# EAGLE design CrackberryPi_1.0.5_test (EAGLE 7.2.0)
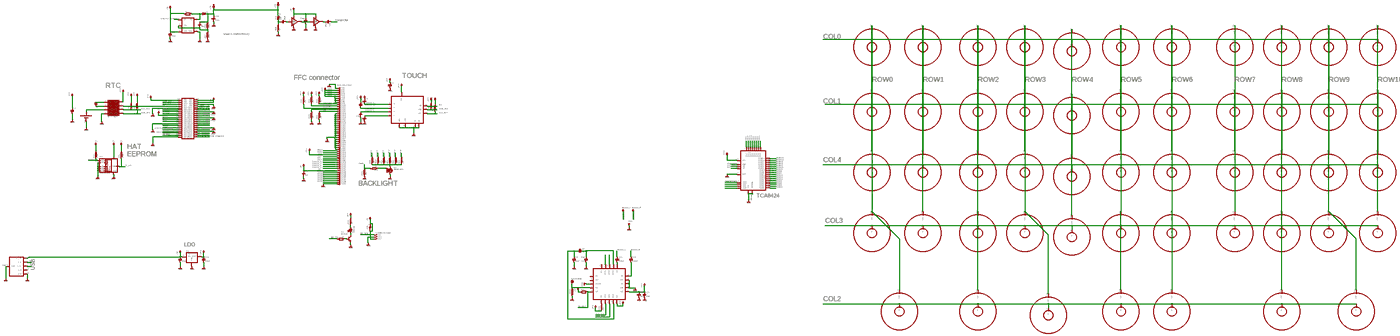
[diagram p0: schematic, sheet 1, overview]
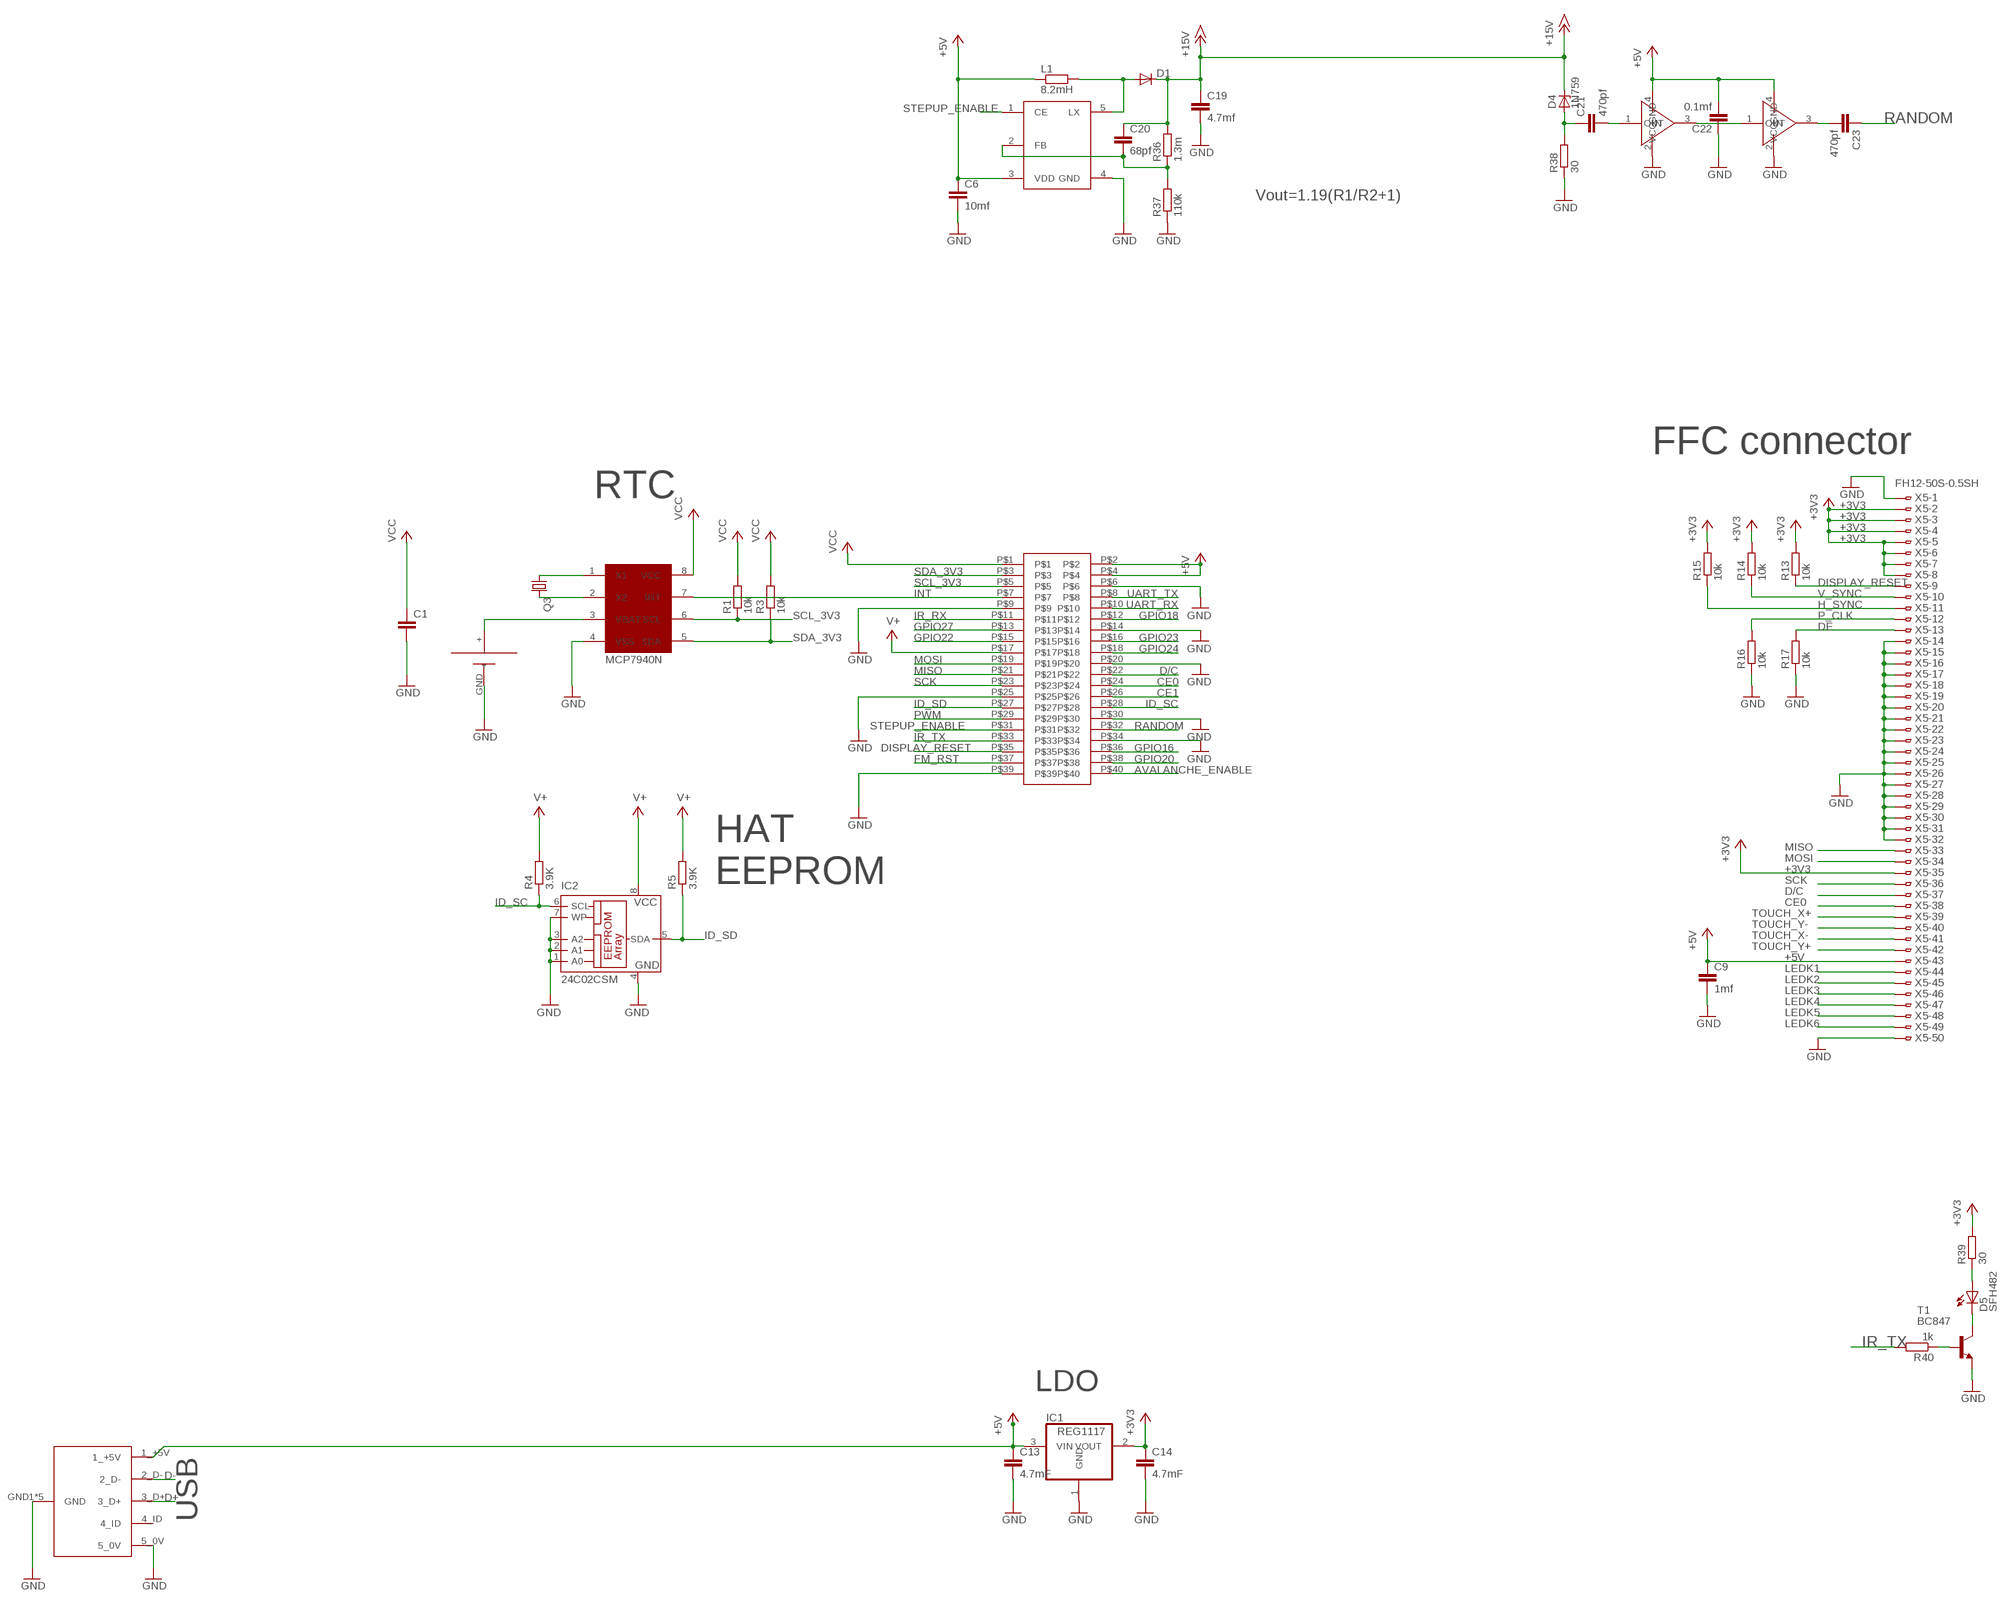
[diagram p1: schematic, sheet 1, part 1 of 4]
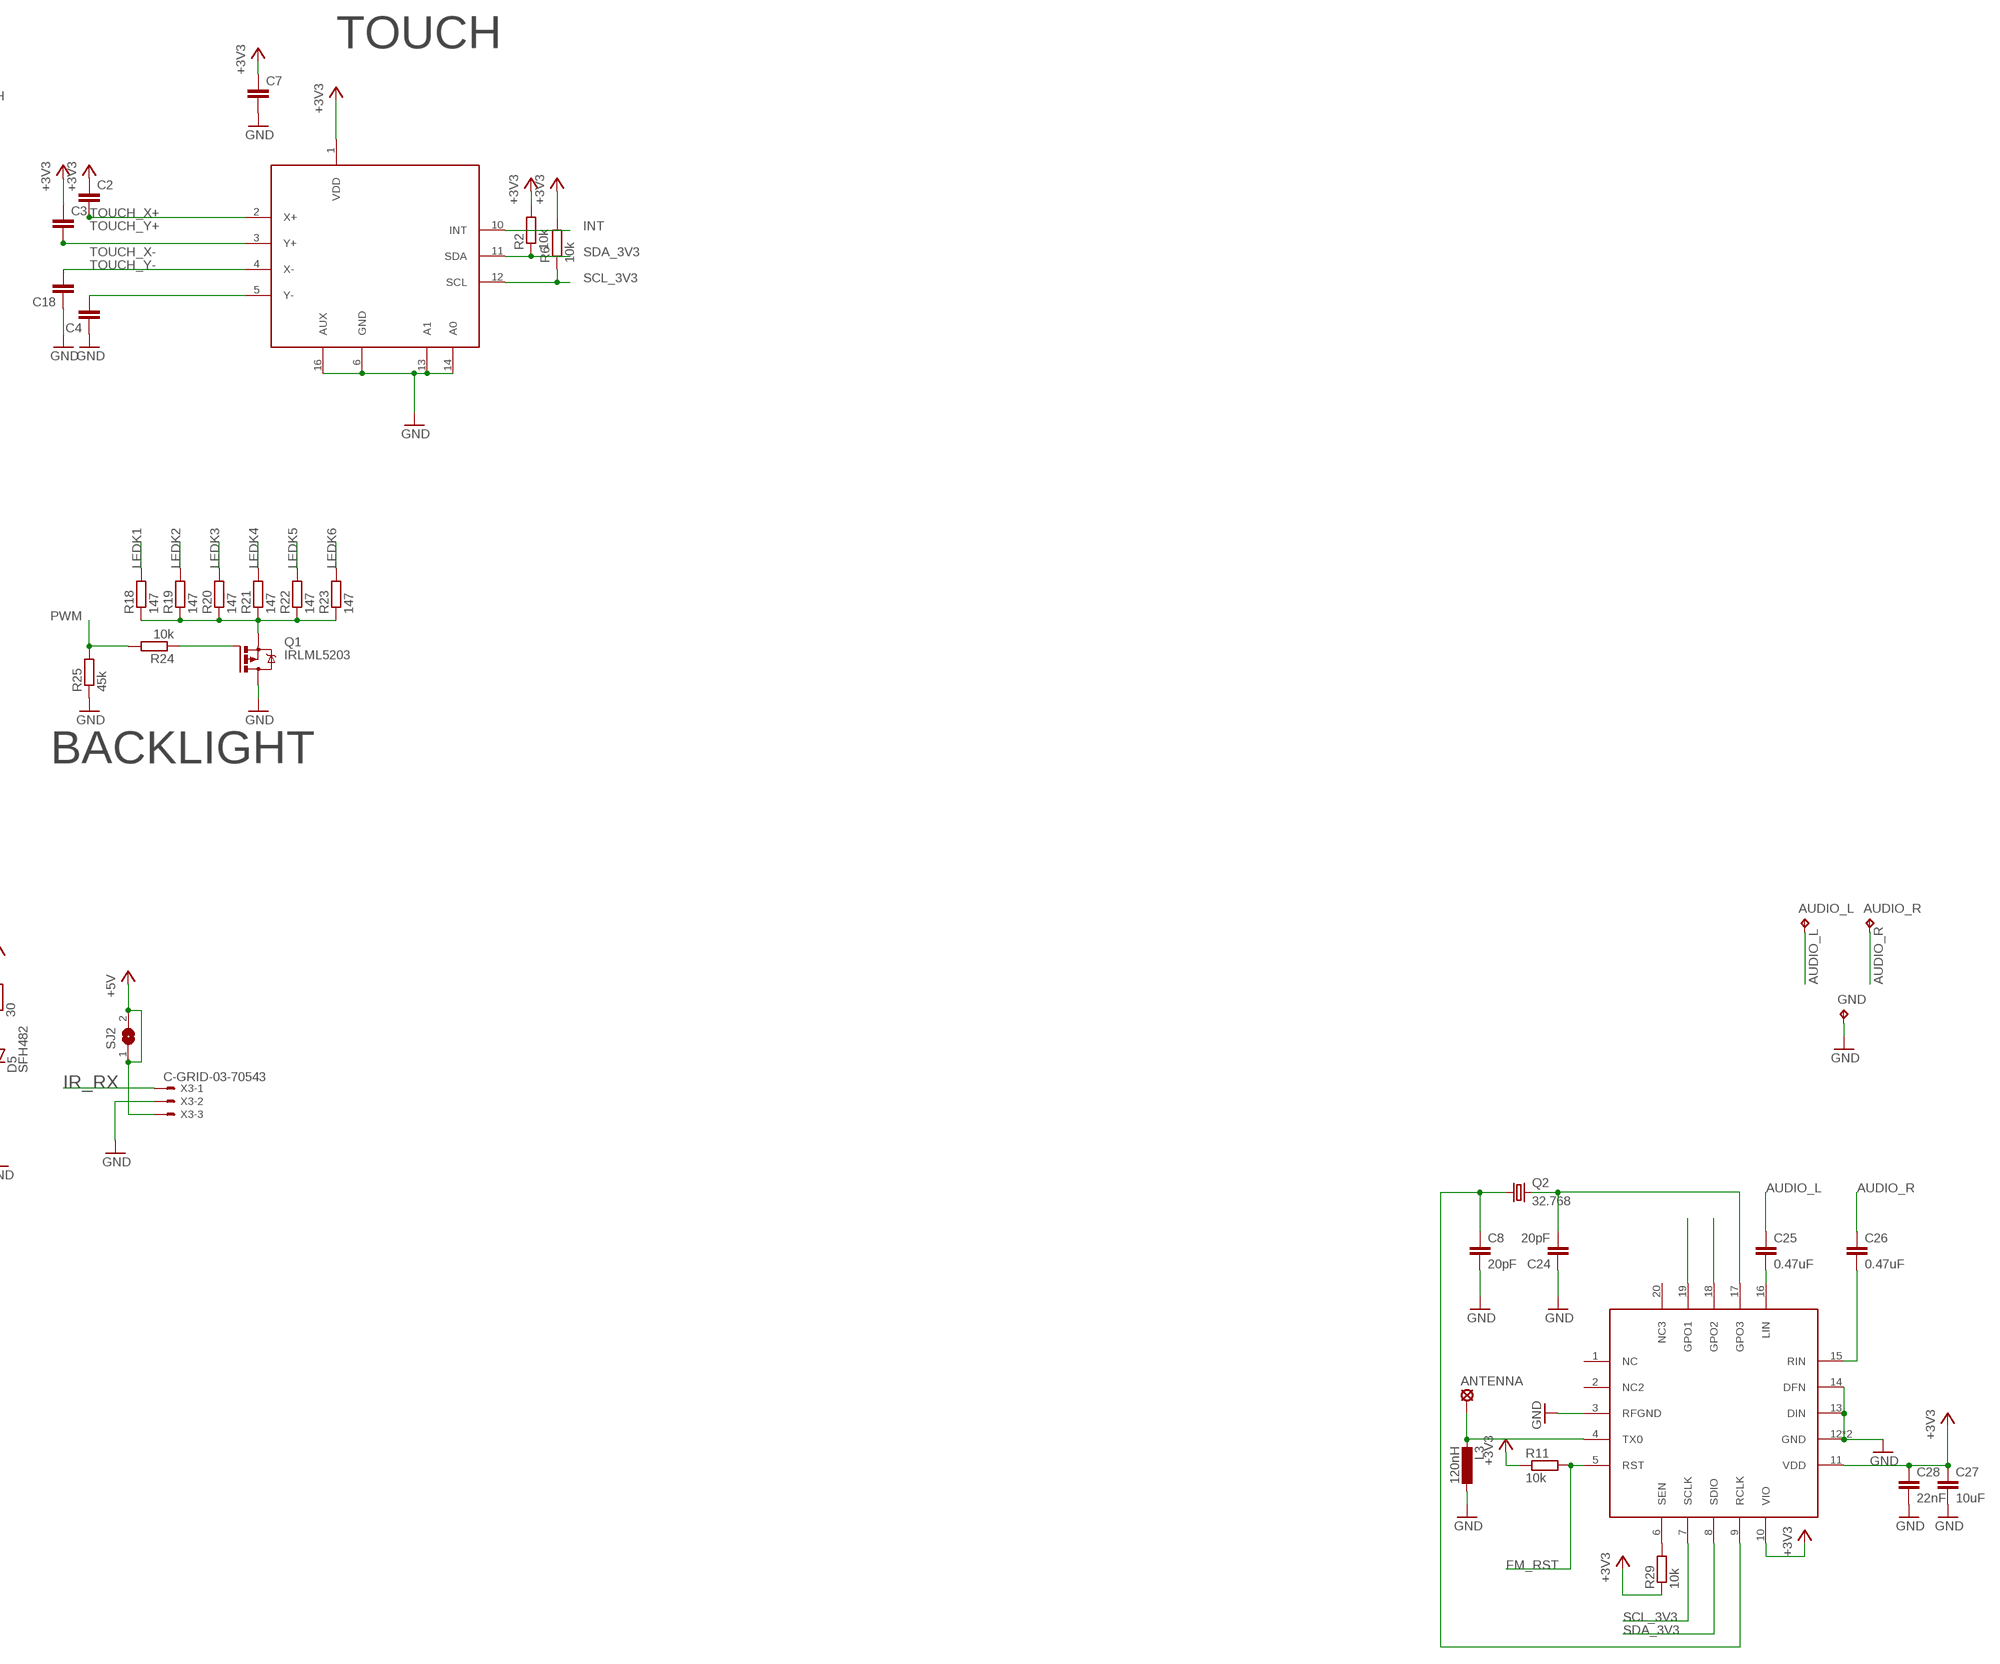
[diagram p2: schematic, sheet 1, part 2 of 4]
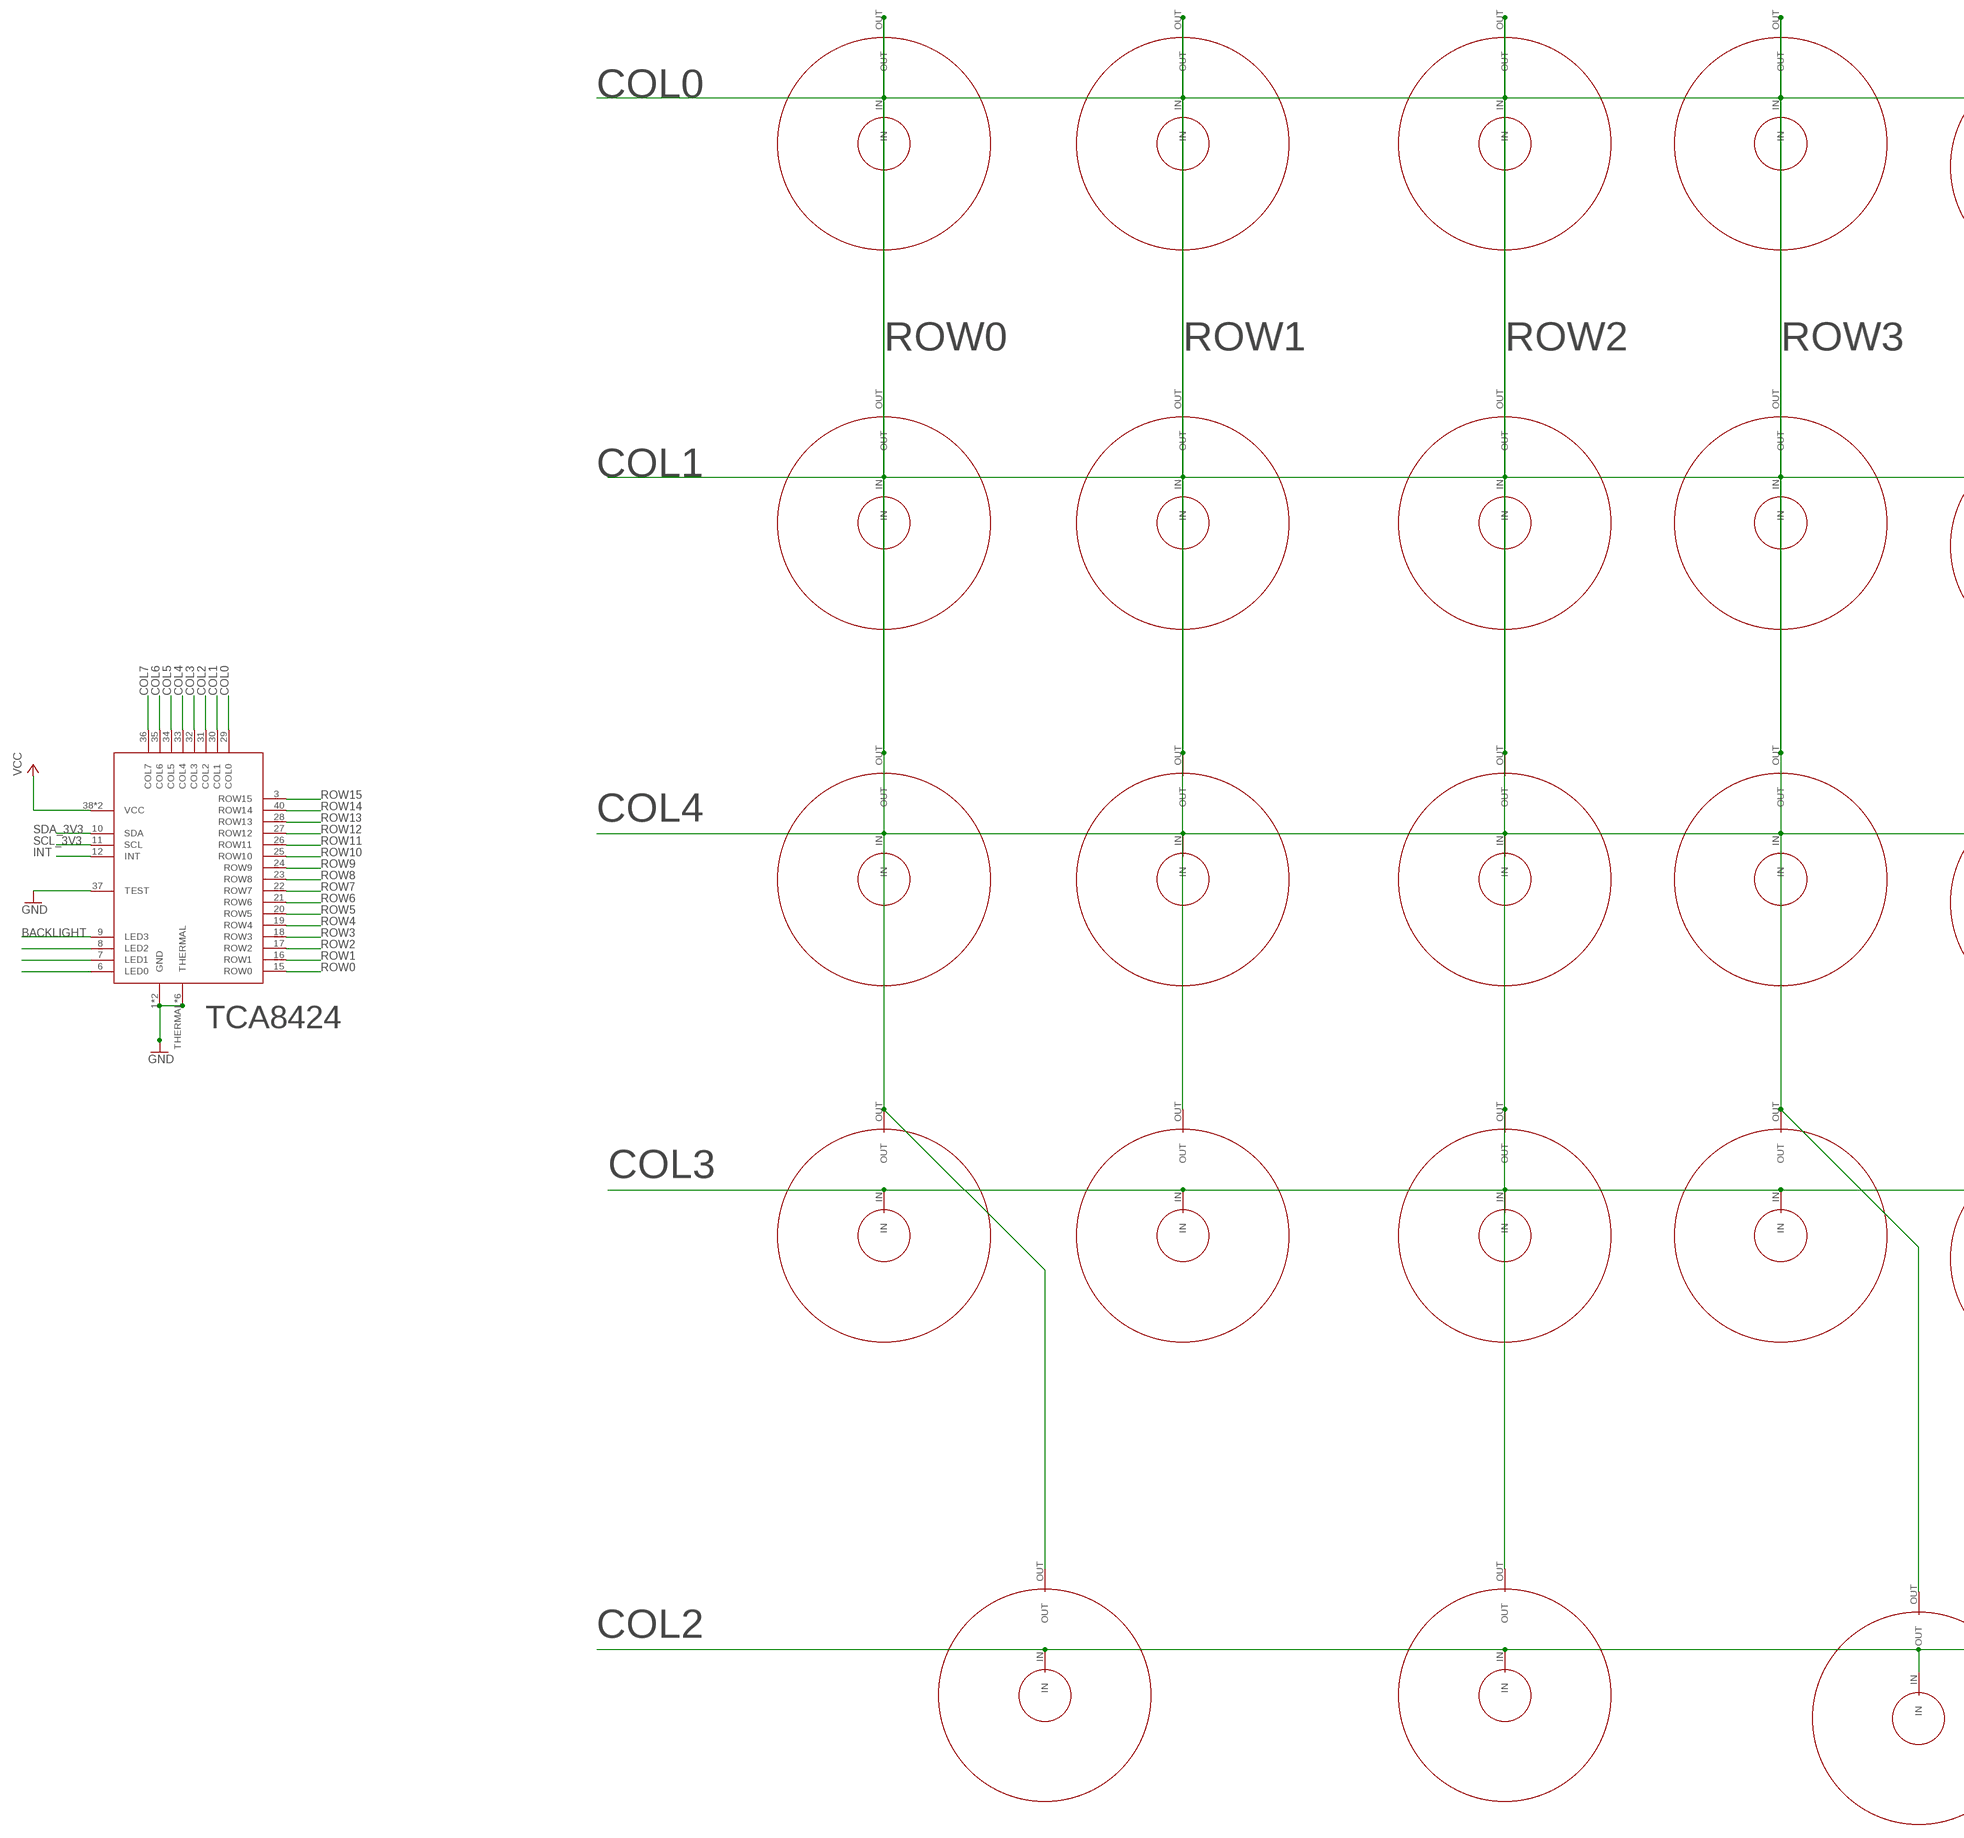
[diagram p3: schematic, sheet 1, part 3 of 4]
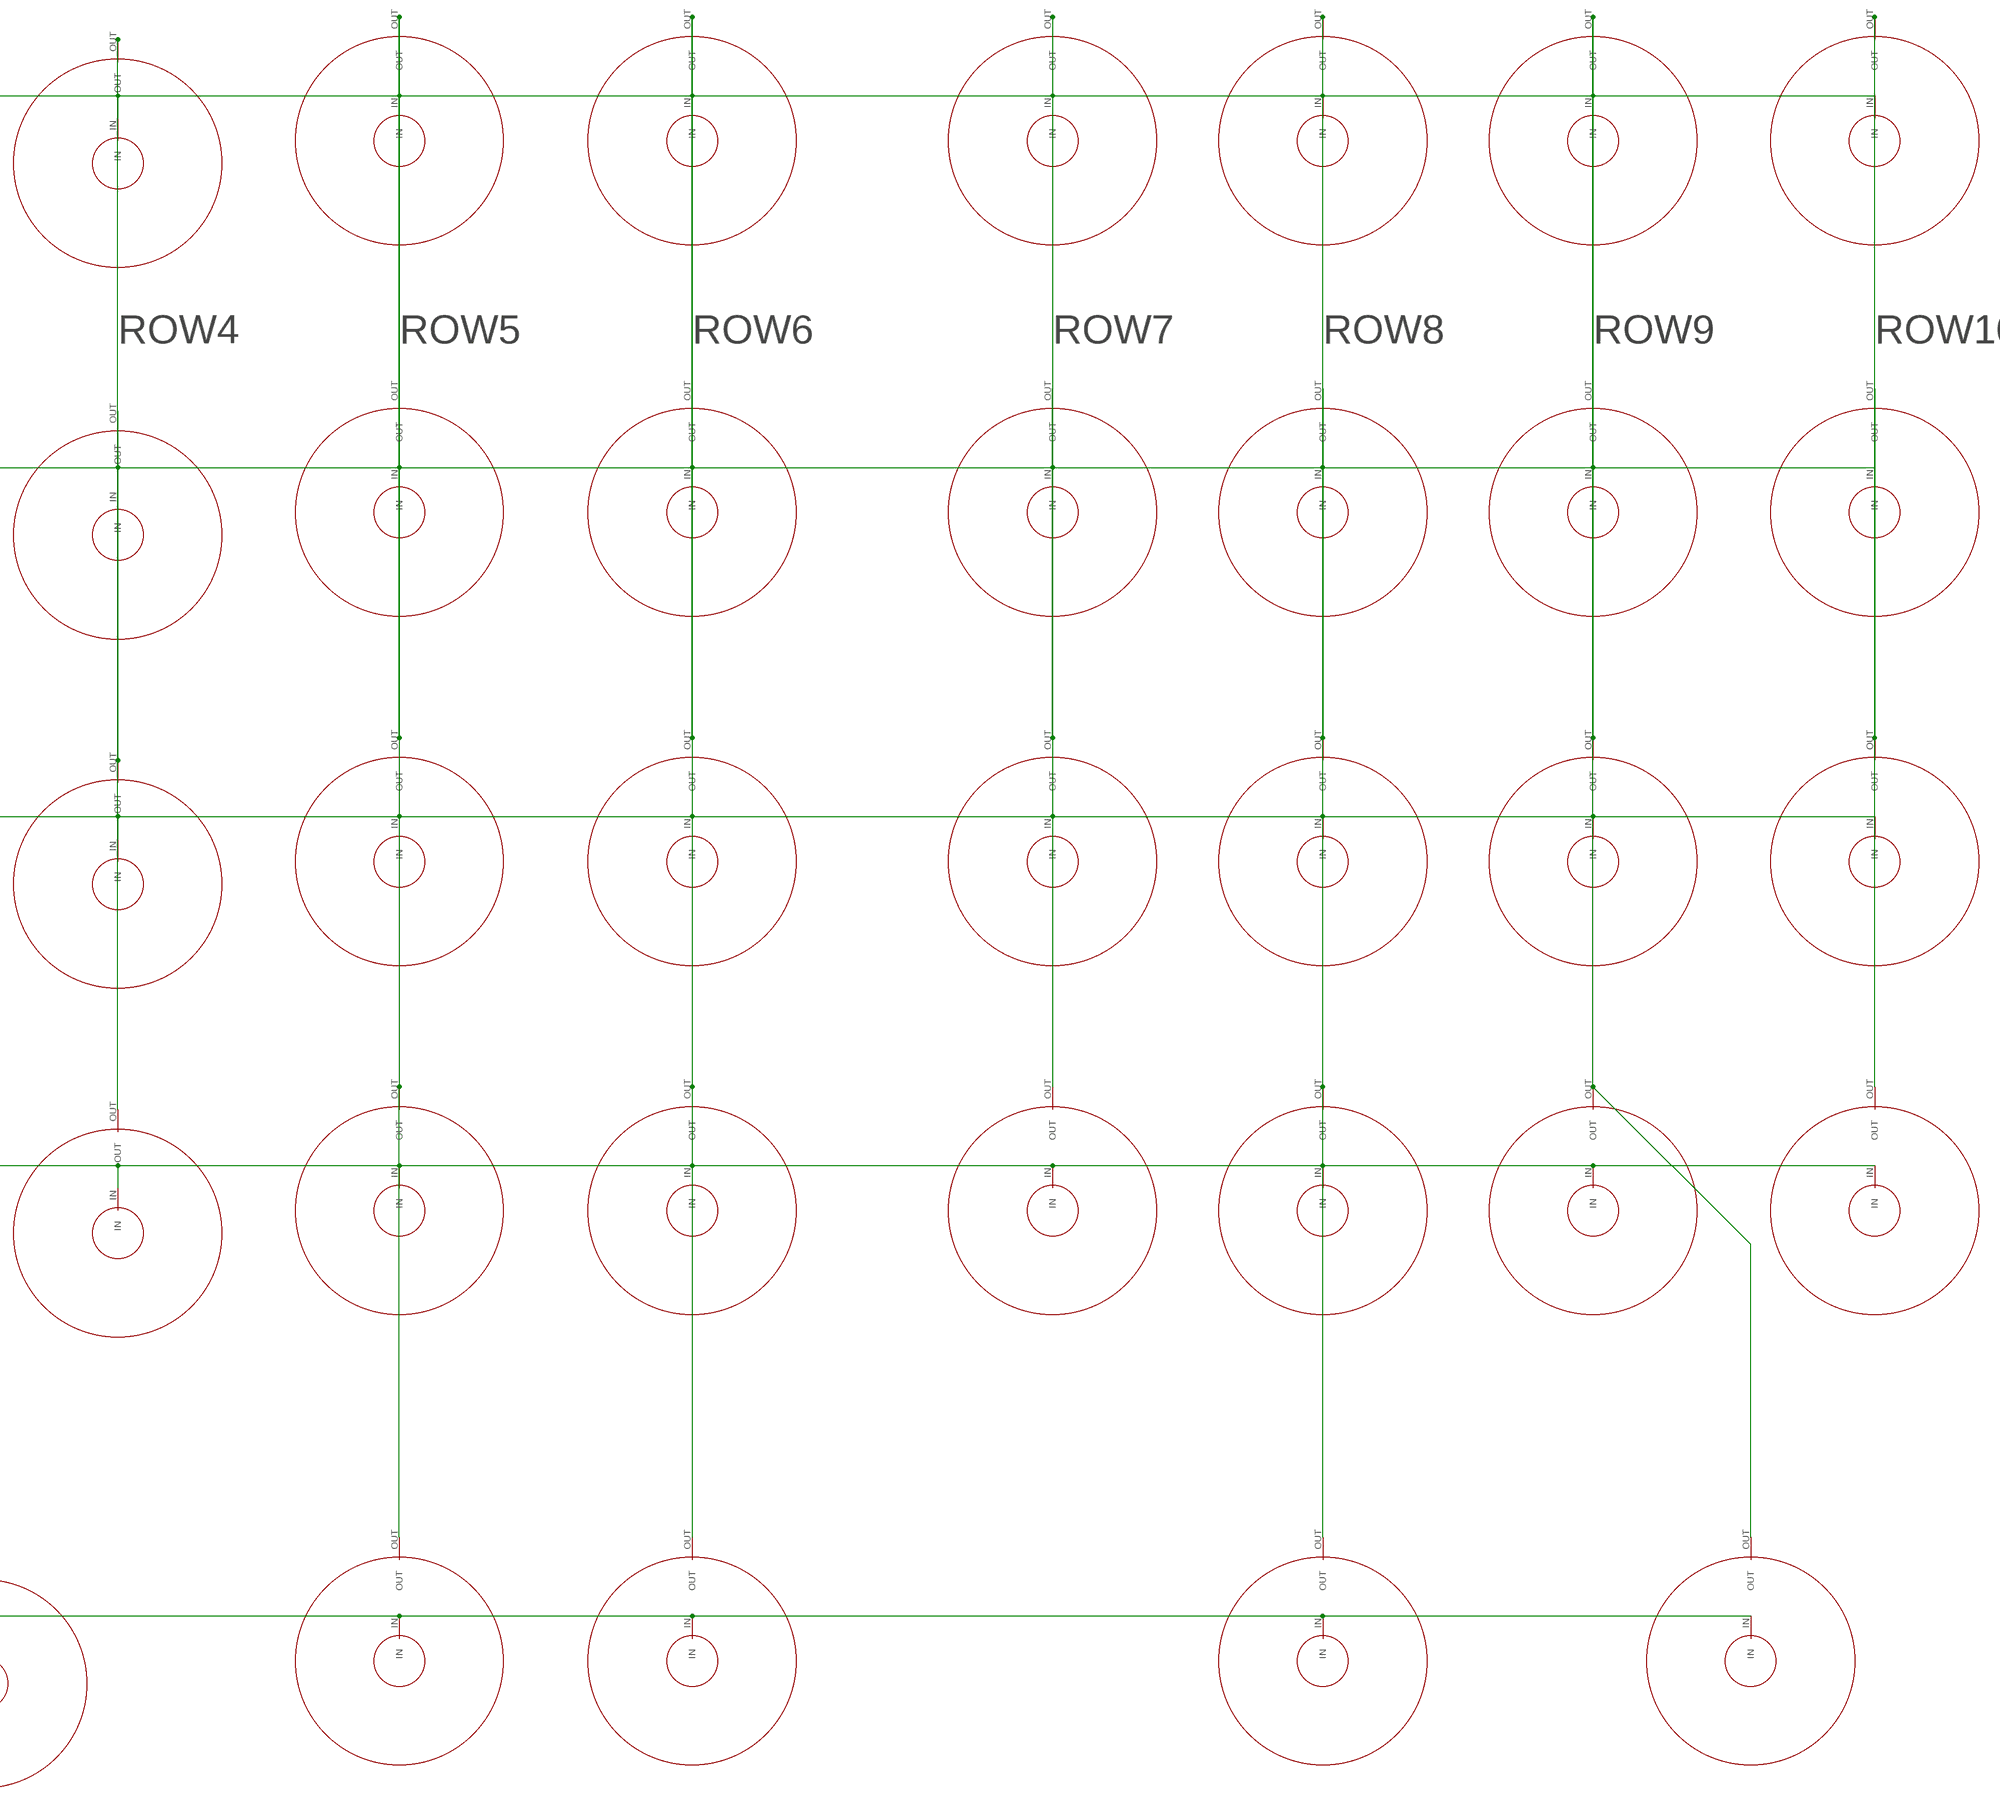
[diagram p4: schematic, sheet 1, part 4 of 4]

## Parts
0  DOME  [4MM]
1  DOME  [4MM]
2  DOME  [4MM]
3  DOME  [4MM]
4  DOME  [4MM]
5  DOME  [4MM]
6  DOME  [4MM]
7  DOME  [4MM]
8  DOME  [4MM]
9  DOME  [4MM]
!  DOME  [4MM]
(  DOME  [4MM]
)  DOME  [4MM]
+  DOME  [4MM]
,  DOME  [4MM]
-  DOME  [4MM]
.  DOME  [4MM]
?  DOME  [4MM]
@  DOME  [4MM]
A  DOME  [4MM]
ANTENNA  LSP10  [LSP10]
AUDIO_L  TPB2,54  [B2,54]
AUDIO_R  TPB2,54  [B2,54]
B  DOME  [4MM]
C  DOME  [4MM]
C1  C-EUC0603  [C0603]
C2  C-EUC0603  [C0603]
C3  C-EUC0603  [C0603]
C4  C-EUC0603  [C0603]
C6  10mf  C-EUC0603  [C0603]
C7  C-EUC0603  [C0603]
C8  20pF  C-EUC0603  [C0603]
C9  1mf  C-EUC0603  [C0603]
C13  4.7mF  C-EUC0603  [C0603]
C14  4.7mF  C-EUC0603  [C0603]
C18  C-EUC0603  [C0603]
C19  4.7mf  C-EUC0603  [C0603]
C20  68pf  C-EUC0603  [C0603]
C21  470pf  C-EUC0603  [C0603]
C22  0.1mf  C-EUC0603  [C0603]
C23  470pf  C-EUC0603  [C0603]
C24  20pF  C-EUC0603  [C0603]
C25  0.47uF  C-EUC0603  [C0603]
C26  0.47uF  C-EUC0603  [C0603]
C27  10uF  C-EUC0603  [C0603]
C28  22nF  C-EUC0603  [C0603]
D  DOME  [4MM]
D1  DIODE-SOD123  [SOD123]
D4  1N759  ZENER-DIODESOD80C  [SOD80C]
D5  SFH482  [SFH482]
E  DOME  [4MM]
F  DOME  [4MM]
FN-RIGHT  DOME  [4MM]
G  DOME  [4MM]
GND  TPB2,54  [B2,54]
H  DOME  [4MM]
I  DOME  [4MM]
IC1  REG1117  [SOT223]
IC2  24C02CSM  [SO-08M]
J  DOME  [4MM]
K  DOME  [4MM]
L  DOME  [4MM]
L1  8.2mH  R-EU_R0805  [R0805]
L3  120nH  L-EUL2012C  [L2012C]
M  DOME  [4MM]
N  DOME  [4MM]
O  DOME  [4MM]
P  DOME  [4MM]
Q  DOME  [4MM]
Q1  IRLML5203  [MICRO3]
Q2  32.768  CRYSTALMM20SS  [MM20SS]
Q3  CRYSTALMM20SS  [MM20SS]
R  DOME  [4MM]
R1  10k  R-EU_R0603  [R0603]
R2  10k  R-EU_R0603  [R0603]
R3  10k  R-EU_R0603  [R0603]
R4  3.9K  R-EU_R0603  [R0603]
R5  3.9K  R-EU_R0603  [R0603]
R6  10k  R-EU_R0603  [R0603]
R11  10k  R-EU_R0603  [R0603]
R13  10k  R-EU_R0603  [R0603]
R14  10k  R-EU_R0603  [R0603]
R15  10k  R-EU_R0603  [R0603]
R16  10k  R-EU_R0603  [R0603]
R17  10k  R-EU_R0603  [R0603]
R18  147  R-EU_R0603  [R0603]
R19  147  R-EU_R0603  [R0603]
R20  147  R-EU_R0603  [R0603]
R21  147  R-EU_R0603  [R0603]
R22  147  R-EU_R0603  [R0603]
R23  147  R-EU_R0603  [R0603]
R24  10k  R-EU_R0603  [R0603]
R25  45k  R-EU_R0603  [R0603]
R29  10k  R-EU_R0603  [R0603]
R36  1.3m  R-EU_R0603  [R0603]
R37  110k  R-EU_R0603  [R0603]
R38  30  R-EU_R0603  [R0603]
R39  30  R-EU_R0603  [R0603]
R40  1k  R-EU_R0603  [R0603]
S  DOME  [4MM]
SHIFT-RIGHT  DOME  [4MM]
SHILFT-LEFT  DOME  [4MM]
SJ2  SJ  [SJ]
SPACE1  DOME  [4MM]
SPACE2  DOME  [4MM]
SPACE3  DOME  [4MM]
T  DOME  [4MM]
T1  BC847  [SOT23]
U  DOME  [4MM]
U$2  NCP1406  [SOT23-5L]
U$3  MAX2650  [SOT143-W]
U$4  CR1216  [CR1216]
U$5  MCP7940N  [SO08]
U$6  TSC2007  [TSSOP16]
U$7  TCA8424  [QFN40]
U$8  SI4713  [QFN20-3X3]
U$9  MICRO_USB  [MICRO_USB]
U$10  MAX2650  [SOT143-W]
U$11  HEADER  [20X2]
V  DOME  [4MM]
W  DOME  [4MM]
X  DOME  [4MM]
X3  C-GRID-03-70543  [70543-03]
X5  FH12-50S-0.5SH  [FH12-50S-0.5SH]
Y  DOME  [4MM]
Z  DOME  [4MM]

## Nets
+3V3: C2.1 C3.1 C7.1 C14.1 C27.1 C28.1 IC1.2(VOUT) R2.2 R6.2 R11.1 R13.2 R14.2 R15.2 R29.1 R39.2 U$6.1(VDD) U$8.10(VIO) U$8.11(VDD) X5.2 X5.3 X5.4 X5.5 X5.6 X5.7 X5.8 X5.35
+5V: C6.1 C9.1 C13.1 C22.2 IC1.3(VIN) L1.1 SJ2.1 SJ2.2 U$2.3(VDD) U$3.4(VCC) U$9.1_+5V U$10.4(VCC) U$11.P$2 U$11.P$4 X3.3 X5.43
+15V: C19.1 C20.1 D1.C D4.C R36.2
AUDIO_L: AUDIO_L.TP C25.1
AUDIO_R: AUDIO_R.TP C26.1
AVALANCHE_ENABLE: U$11.P$40
BACKLIGHT: U$7.9(LED3)
BASE: R40.1 T1.1(B)
CE0: U$11.P$24 X5.38
CE1: U$11.P$26
COL0: 0.IN 1.IN 2.IN 3.IN 4.IN 5.IN 6.IN 7.IN 8.IN 9.IN -.IN U$7.29(COL0)
COL1: +.IN E.IN I.IN O.IN P.IN Q.IN R.IN T.IN U$7.30(COL1) U.IN W.IN Y.IN
COL2: @.IN FN-RIGHT.IN SHIFT-RIGHT.IN SHILFT-LEFT.IN SPACE1.IN SPACE2.IN SPACE3.IN U$7.31(COL2)
COL3: !.IN ,.IN ..IN ?.IN B.IN C.IN M.IN N.IN U$7.32(COL3) V.IN X.IN Z.IN
COL4: (.IN ).IN A.IN D.IN F.IN G.IN H.IN J.IN K.IN L.IN S.IN U$7.33(COL4)
COL5: U$7.34(COL5)
COL6: U$7.35(COL6)
COL7: U$7.36(COL7)
COLLECTOR: D5.K(C) T1.3(C)
D+: U$9.3_D+
D-: U$9.2_D-
D/C: U$11.P$22 X5.37
DE: R17.2 X5.13
DISPLAY_RESET: R13.1 U$11.P$35 X5.9
EMITTER: T1.2(E) ; supply symbol labelled GND
FB: C20.2 R36.1 R37.2 U$2.2(FB)
FM_RST: R11.2 U$8.5(RST) U$11.P$37
GND: C1.2 C4.1 C6.2 C7.2 C8.2 C9.2 C13.2 C14.2 C18.1 C19.2 C22.1 C24.1 C27.2 C28.2 GND.TP IC1.1(GND) IC2.1(A0) IC2.2(A1) IC2.3(A2) IC2.4(GND) IC2.7(WP) L3.1 Q1.3(D) R16.1 R17.1 R25.1 R37.1 R38.1 U$2.4(GND) U$3.2(GND) U$4.GND(-) U$5.4(VSS) U$6.6(GND) U$6.13(A1) U$6.14(A0) U$6.16(AUX) U$7.1(GND) U$7.4(GND) U$7.37(TEST) U$7.THERMAL U$7.VIA1(THERMAL) U$7.VIA2(THERMAL) U$7.VIA3(THERMAL) U$7.VIA4(THERMAL) U$7.VIA5(THERMAL) U$8.3(RFGND) U$8.12(GND) U$8.13(DIN) U$8.14(DFN) U$8.P$1(GND) U$9.5_0V U$9.GND1(GND) U$9.GND2(GND) U$9.GND5(GND) U$9.P$1(GND) U$9.P$7(GND) U$10.2(GND) U$11.P$6 U$11.P$9 U$11.P$14 U$11.P$20 U$11.P$25 U$11.P$30 U$11.P$34 U$11.P$39 X3.2 X5.1 X5.14 X5.15 X5.16 X5.17 X5.18 X5.19 X5.20 X5.21 X5.22 X5.23 X5.24 X5.25 X5.26 X5.27 X5.28 X5.29 X5.30 X5.31 X5.32 X5.50
GPIO16: U$11.P$36
GPIO18: U$11.P$12
GPIO20: U$11.P$38
GPIO22: U$11.P$15
GPIO23: U$11.P$16
GPIO24: U$11.P$18
GPIO27: U$11.P$13
GPO1: U$8.19(GPO1)
GPO2: U$8.18(GPO2)
H_SYNC: R15.1 X5.11
ID_SC: IC2.6(SCL) R4.1 U$11.P$28
ID_SD: IC2.5(SDA) R5.1 U$11.P$27
IN_1: C21.2 U$3.1(IN)
INT: U$5.7(INT) U$6.10(INT) U$7.12(INT) U$11.P$7
IR_RX: U$11.P$11 X3.1
IR_TX: R40.2 U$11.P$33
LEDK1: R18.2 X5.44
LEDK2: R19.2 X5.45
LEDK3: R20.2 X5.46
LEDK4: R21.2 X5.47
LEDK5: R22.2 X5.48
LEDK6: R23.2 X5.49
LX: D1.A L1.2 U$2.5(LX)
MISO: U$11.P$21 X5.33
MOSI: U$11.P$19 X5.34
N$1: C24.2 Q2.4 U$8.17(GPO3)
N$10: U$7.6(LED0)
N$11: Q3.1 U$5.1(X1)
N$12: Q1.2(S) R18.1 R19.1 R20.1 R21.1 R22.1 R23.1
N$13: Q3.4 U$5.2(X2)
N$14: U$7.7(LED1)
N$16: C21.1 D4.A R38.2
N$18: U$7.8(LED2)
N$19: C8.1 Q2.1 U$8.9(RCLK)
N$20: Q1.1(G) R24.1
N$22: C25.2 U$8.16(LIN)
N$23: C26.2 U$8.15(RIN)
N$25: ANTENNA.MP L3.2 U$8.4(TX0)
N$26: R29.2 U$8.6(SEN)
N$30: D5.A R39.1
OUT1_IN2: U$3.3(OUT) U$10.1(IN)
OUT2: C23.2 U$10.3(OUT)
P_CLK: R16.2 X5.12
PWM: R24.2 R25.2 U$11.P$29
RANDOM: C23.1 U$11.P$32
ROW0: 1.OUT A.OUT Q.OUT SHILFT-LEFT.OUT U$7.15(ROW0) Z.OUT
ROW1: 2.OUT S.OUT U$7.16(ROW1) W.OUT X.OUT
ROW2: 3.OUT C.OUT D.OUT E.OUT SPACE1.OUT U$7.17(ROW2)
ROW3: 4.OUT F.OUT R.OUT SPACE2.OUT U$7.18(ROW3) V.OUT
ROW4: 5.OUT B.OUT G.OUT T.OUT U$7.19(ROW4)
ROW5: 6.OUT H.OUT N.OUT SPACE3.OUT U$7.20(ROW5) Y.OUT
ROW6: 7.OUT J.OUT M.OUT SHIFT-RIGHT.OUT U$7.21(ROW6) U.OUT
ROW7: 8.OUT ?.OUT I.OUT K.OUT U$7.22(ROW7)
ROW8: 9.OUT !.OUT @.OUT L.OUT O.OUT U$7.23(ROW8)
ROW9: 0.OUT (.OUT ,.OUT FN-RIGHT.OUT P.OUT U$7.24(ROW9)
ROW10: ).OUT +.OUT -.OUT ..OUT U$7.25(ROW10)
ROW11: U$7.26(ROW11)
ROW12: U$7.27(ROW12)
ROW13: U$7.28(ROW13)
ROW14: U$7.40(ROW14)
ROW15: U$7.3(ROW15)
SCK: U$11.P$23 X5.36
SCL_3V3: R1.1 R6.1 U$5.6(SCL) U$6.12(SCL) U$7.11(SCL) U$8.7(SCLK) U$11.P$5
SDA_3V3: R2.1 R3.1 U$5.5(SDA) U$6.11(SDA) U$7.10(SDA) U$8.8(SDIO) U$11.P$3
STEPUP_ENABLE: U$2.1(CE) U$11.P$31
TOUCH_X+: C2.2 U$6.2(X+) X5.39
TOUCH_X-: C18.2 U$6.4(X-) X5.41
TOUCH_Y+: C3.2 U$6.3(Y+) X5.42
TOUCH_Y-: C4.2 U$6.5(Y-) X5.40
UART_RX: U$11.P$10
UART_TX: U$11.P$8
V+: IC2.8(VCC) R4.2 R5.2 U$11.P$17
V_SYNC: R14.1 X5.10
VBAT+: U$4.+ U$5.3(VBAT)
VCC: C1.1 R1.2 R3.2 U$5.8(VCC) U$7.38(VCC) U$7.39(VCC) U$11.P$1
Unconnected: U$8.1(NC) U$8.2(NC2) U$8.20(NC3) U$9.4_ID

## Notes on the sheet
- Vout=1.19(R1/R2+1)
- FFC connector | TOUCH
- RTC
- MCP7940N
- HAT
  EEPROM
- BACKLIGHT
- TCA8424
- LDO
- USB

## Library data of the parts
0 1-9 ! ( ) + , - . ? @ A B C D E F FN-RIGHT G H I J K L M N O P Q R S SHIFT-RIGHT SHILFT-LEFT SPACE1-SPACE3 T U V W X Y Z = DOME:DOME
ANTENNA = solpad:LSP10: SOLDER PAD drill 1.0 mm, distributor Buerklin, 12H555
AUDIO_L AUDIO_R GND = testpad:TP: Test pad
C1-C4 C6-C9 C13 C14 C18-C28 = rcl:C-EU: CAPACITOR, European symbol
D1 = diode:DIODE-: DIODE
D4 = diode:ZENER-DIODE: Z-Diode
D5 = led:SFH482: IR LED infrared emitting diode, Infineon
IC1 = burr-brown:REG1117: 800mA and 1A Low Dropout (LDO) Positive Regulator 1.8V, 2.5V, 2.85V, 3.3V, 5V, and Adj; MPN: REG1117; OC_FARNELL: 1097566; OC_NEWARK: 14P6981
IC2 = microchip:24C*: Serial EEPROM 1 K/2 K/4 K; MF: MICROCHIP; MPN: 24C02C-I/SN; OC_FARNELL: 1084339; OC_NEWARK: 96K4063
L1 R1-R6 R11 R13-R25 R29 R36-R40 = rcl:R-EU_: RESISTOR, European symbol
L3 = rcl:L-EU: INDUCTOR, European symbol
Q1 = transistor-power:IRLML5203: HEXFET P-Channel Power MOSFET
Q2 Q3 = crystal:CRYSTAL: CRYSTAL; OC_FARNELL: unknown; OC_NEWARK: unknown
SJ2 = jumper:SJ: SMD solder JUMPER
T1 = transistor:BC847: NPN TRANSISTOR
U$2 = ncp1406:NCP1406
U$3 U$10 = max2650:MAX2650
U$4 = cr1216:CR1216
U$5 = MCP7940N:MCP7940N
U$6 = tsc2046:TSC2007
U$7 = TCA8424:TCA8424
U$8 = Si4713:SI4713
U$9 = MICRO_USB:MICRO_USB
U$11 = 20x2_cirqoid:HEADER
X3 = con-molex:C-GRID-03: CONNECTOR wire to board 2.54 mm (0.100") pitch header; OC_FARNELL: unknown; OC_NEWARK: unknown
X5 = FCI_62684:FH12-50S-0.5S: 0.5mm Pitch Connectors For FPC/FFC Source: Data sheet <http://www.hirose.co.jp/cataloge_hp/e58605370.pdf>; MPN: FH12-50S-0.5SH(55); OC_FARNELL: 1324557; OC_NEWARK: 34M6181

## Board
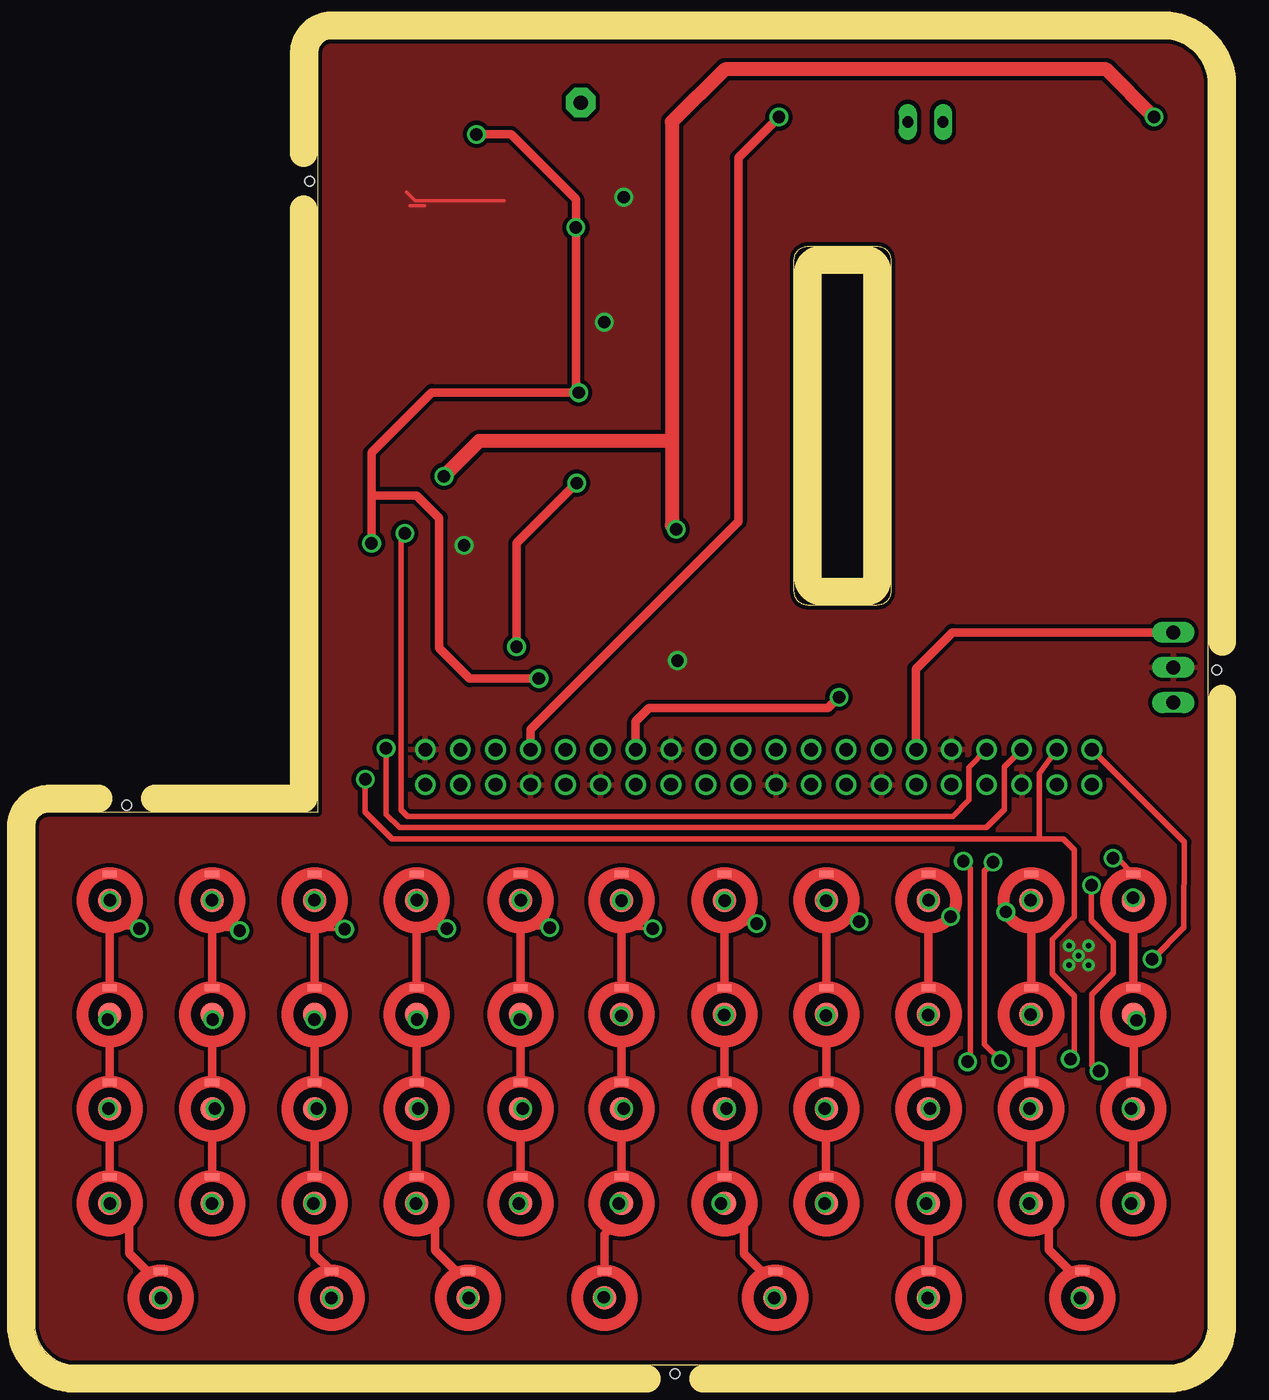
[diagram p5: board, top side]
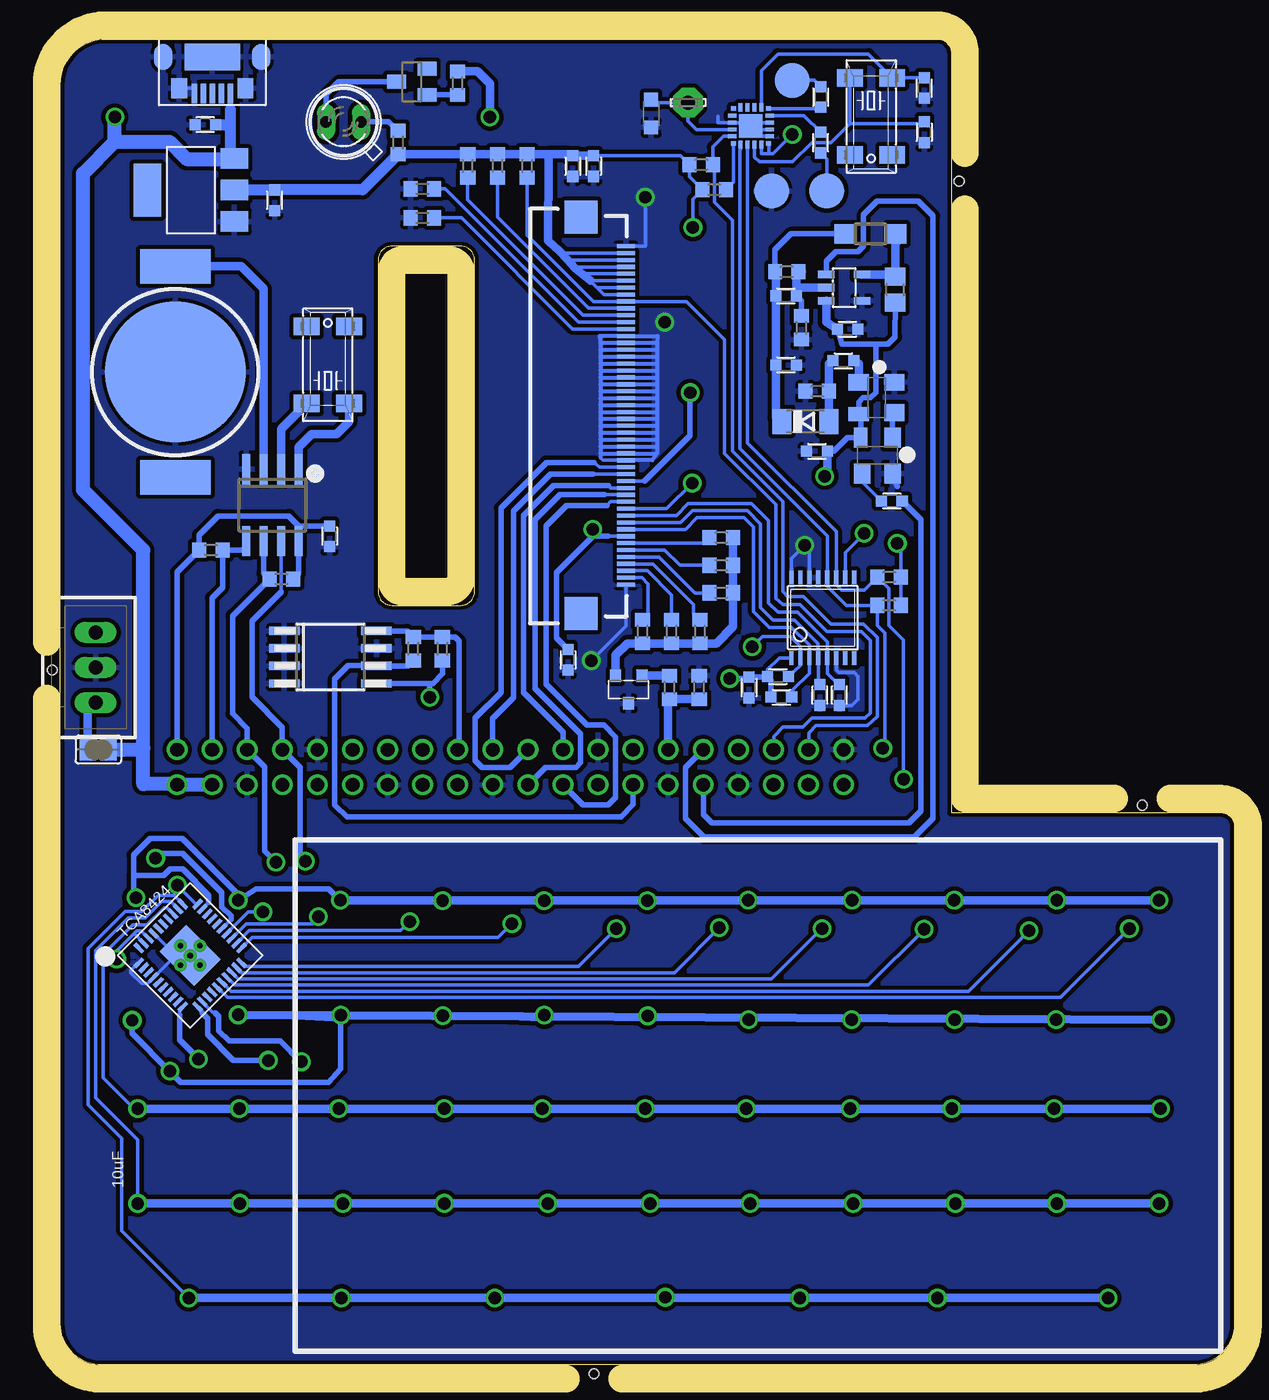
[diagram p6: board, bottom side, seen from below]

Size 85 x 96 mm. Coordinates in mm from the lower left corner, seen from the top.
Outline: 0,39 0,3 arc90 3,0 82,0 arc90 85,3 85,92.7 arc90 81.7,96 21.5,96 arc90 20.5,95 20.5,40 1,40 arc90 0,39
Outline: 56,81 61,81 arc-90 62,80 62,56 arc-90 61,55 56,55 arc-90 55,56 55,80 arc-90 56,81
Copper layers (1*16): Top 0.035mm / dielectric 1.5mm / Bottom 0.035mm
Design rules "SeeedStudio_2layer_DRU_no_angle_20140221": minimum track width 6mil, minimum drill 12mil, track to track 6mil, track to pad 6mil, pad to pad 6mil, via to via 6mil, smd to smd 0mil, copper to edge 10mil, drill to drill 10mil, minimum pad ring 10mil, minimum via ring 6mil, stop-mask expansion 2mil, vias tented up to drill 100mil, thermal gap 10mil
Holes 0.7 mm at 19.93,85.7 85.6,50.3 6.67,40.52 46.38,-0.62
bRestrict: area 42.5,73.2 to 45.4,73.3; area 42.5,72.7 to 45.4,72.8; area 42.5,72.2 to 45.4,72.3; area 42.5,71.7 to 45.4,71.8; area 42.5,71.2 to 45.4,71.3; area 42.5,70.7 to 45.4,70.8; area 42.5,70.2 to 45.4,70.3; area 42.5,69.7 to 45.4,69.8; area 42.5,69.2 to 45.4,69.3; area 42.5,68.7 to 45.4,68.8; area 42.5,68.2 to 45.4,68.3; area 42.5,67.7 to 45.4,67.8; 8 more areas
Milling: 24 lines

### Footprints (pad centres in the part's own frame; a part is rotated, then mirrored left to right if it is on the bottom)
4MM = smd 1.7 x 1.7: IN 0,0 | smd 1 x 0.5: OUT 0,1.9
LSP10 = drill 1.016 pad 2.159 octagon: MP 0,0
B2,54 = smd 2.54 x 2.54: TP 0,0
C0603 = smd 0.8 x 0.8: 1 -0.75,0; 2 0.75,0
SOD123 = smd 1.4 x 1.4: A 1.9,0; C -1.9,0
SOD80C = smd 1.4 x 1.8: A 1.7,0; C -1.7,0
SFH482 = drill 0.813 long: A -1.27,0; K 1.27,0
SOT223 = smd 1.499 x 2.007: 1 -2.261,-3.15; 2 0.025,-3.15; 3 2.311,-3.15 | smd 3.81 x 2.007: 4 0,3.15
SO-08M = smd 0.6 x 2.2: 1 -1.905,-3.33; 2 -0.635,-3.33; 3 0.635,-3.33; 4 1.905,-3.33; 5 1.905,3.33; 6 0.635,3.33; 7 -0.635,3.33; 8 -1.905,3.33
R0805 = smd 1.3 x 1.5: 1 -0.95,0; 2 0.95,0
L2012C = smd 1 x 1: 1 -1,0; 2 1,0
MICRO3 = smd 0.8 x 0.9: 1 -0.95,-1; 2 0.95,-1; 3 0,1
MM20SS = smd 1.27 x 1.88: 1 -2.794,-1.524; 2 2.794,-1.524; 3 2.794,1.524; 4 -2.794,1.524
R0603 = smd 1 x 1.1: 1 -0.85,0; 2 0.85,0
SJ = smd 1.168 x 1.6: 1 -0.762,0; 2 0.762,0
SOT23 = smd 1 x 1.4: 1 -0.95,-1.1; 2 0.95,-1.1; 3 0,1.1
SOT23-5L = smd 0.55 x 1.2: 1 -0.95,-1.3; 2 0,-1.3; 3 0.95,-1.3; 4 0.95,1.3; 5 -0.95,1.3
SOT143-W = smd 1.2 x 1.45: 1 -1.1,-1.3; 2 -1.1,1.3; 3 1.1,1.3 | smd 1 x 1.45: 4 1.2,-1.3
CR1216 = smd 2.5 x 5.1: + -7.65,0; P$2 7.65,0 | smd 10.2 x 10.2: GND 0,0
SO08 = smd 0.6 x 2.2: 1 -1.905,-2.6; 2 -0.635,-2.6; 3 0.635,-2.6; 4 1.905,-2.6; 5 1.905,2.6; 6 0.635,2.6; 7 -0.635,2.6; 8 -1.905,2.6
TSSOP16 = smd 0.305 x 0.991: 1 -2.275,-2.918; 2 -1.625,-2.918; 3 -0.975,-2.918; 4 -0.325,-2.918; 5 0.325,-2.918; 6 0.975,-2.918; 7 1.625,-2.918; 8 2.275,-2.918; 9 2.275,2.918; 10 1.625,2.918; 11 0.975,2.918; 12 0.325,2.918; 13 -0.325,2.918; 14 -0.975,2.918; 15 -1.625,2.918; 16 -2.275,2.918
QFN40 = smd 0.85 x 0.28: 1 -3,2.25; 2 -3,1.75; 3 -3,1.25; 4 -3,0.75; 5 -3,0.25; 6 -3,-0.25; 7 -3,-0.75; 8 -3,-1.25; 9 -3,-1.75; 10 -3,-2.25; 21 3,-2.25; 22 3,-1.75; 23 3,-1.25; 24 3,-0.75; 25 3,-0.25; 26 3,0.25; 27 3,0.75; 28 3,1.25; 29 3,1.75; 30 3,2.25 | smd 0.28 x 0.85: 11 -2.25,-3; 12 -1.75,-3; 13 -1.25,-3; 14 -0.75,-3; 15 -0.25,-3; 16 0.25,-3; 17 0.75,-3; 18 1.25,-3; 19 1.75,-3; 20 2.25,-3; 31 2.25,3; 32 1.75,3; 33 1.25,3; 34 0.75,3; 35 0.25,3; 36 -0.25,3; 37 -0.75,3; 38 -1.25,3; 39 -1.75,3; 40 -2.25,3 | smd 2.7 x 3.5: P$2 0,0 | smd 1 x 1.5: P$11 -0.65,0.9; P$12 0.65,0.9; P$13 0.65,-0.9; THERMAL -0.65,-0.9 | drill 0.4 pad 0.406: VIA1 0,1; VIA2 -1,0; VIA3 0,0; VIA4 1,0; VIA5 0,-1
QFN20-3X3 = smd 0.34 x 0.34: 1 -1.27,1.27; 6 -1.27,-1.27; 11 1.27,-1.27; 16 1.27,1.27 | smd 0.61 x 0.28: 2 -1.35,0.75; 3 -1.35,0.25; 4 -1.35,-0.25; 5 -1.35,-0.75; 12 1.35,-0.75; 13 1.35,-0.25; 14 1.35,0.25; 15 1.35,0.75 | smd 0.28 x 0.61: 7 -0.75,-1.35; 8 -0.25,-1.35; 9 0.25,-1.35; 10 0.75,-1.35; 17 0.75,1.35; 18 0.25,1.35; 19 -0.25,1.35; 20 -0.75,1.35 | smd 1.7 x 1.7: P$1 0,0
MICRO_USB = smd 0.4 x 1.4: 1_+5V -1.3,2.65; 2_D- -0.65,2.65; 3_D+ 0,2.65; 4_ID 0.65,2.65; 5_0V 1.3,2.65 | smd 4 x 1.9: GND1 0,0 | smd 1.35 x 1.9: GND2 -3.55,0; GND5 3.55,0 | smd 1.15 x 1.45: P$1 -2.4,2.25; P$7 2.4,2.25
20X2 = drill 1: P$1 0,0; P$2 0,2.54; P$3 2.54,0; P$4 2.54,2.54; P$5 5.08,0; P$6 5.08,2.54; P$7 7.62,0; P$8 7.62,2.54; P$9 10.16,0; P$10 10.16,2.54; P$11 12.7,0; P$12 12.7,2.54; P$13 15.24,0; P$14 15.24,2.54; P$15 17.78,0; P$16 17.78,2.54; P$17 20.32,0; P$18 20.32,2.54; P$19 22.86,0; P$20 22.86,2.54; P$21 25.4,0; P$22 25.4,2.54; P$23 27.94,0; P$24 27.94,2.54; P$25 30.48,0; P$26 30.48,2.54; P$27 33.02,0; P$28 33.02,2.54; P$29 35.56,0; P$30 35.56,2.54; P$31 38.1,0; P$32 38.1,2.54; P$33 40.64,0; P$34 40.64,2.54; P$35 43.18,0; P$36 43.18,2.54; P$37 45.72,0; P$38 45.72,2.54; P$39 48.26,0; P$40 48.26,2.54
70543-03 = drill 1.016 long: 1 -2.54,0; 2 0,0; 3 2.54,0
FH12-50S-0.5SH = smd 1.3 x 0.3: 1 3.95,27.8; 2 3.95,27.3; 3 3.95,26.8; 4 3.95,26.3; 5 3.95,25.8; 6 3.95,25.3; 7 3.95,24.8; 8 3.95,24.3; 9 3.95,23.8; 10 3.95,23.3; 11 3.95,22.8; 12 3.95,22.3; 13 3.95,21.8; 14 3.95,21.3; 15 3.95,20.8; 16 3.95,20.3; 17 3.95,19.8; 18 3.95,19.3; 19 3.95,18.8; 20 3.95,18.3; 21 3.95,17.8; 22 3.95,17.3; 23 3.95,16.8; 24 3.95,16.3; 25 3.95,15.8; 26 3.95,15.3; 27 3.95,14.8; 28 3.95,14.3; 29 3.95,13.8; 30 3.95,13.3; 31 3.95,12.8; 32 3.95,12.3; 33 3.95,11.8; 34 3.95,11.3; 35 3.95,10.8; 36 3.95,10.3; 37 3.95,9.8; 38 3.95,9.3; 39 3.95,8.8; 40 3.95,8.3; 41 3.95,7.8; 42 3.95,7.3; 43 3.95,6.8; 44 3.95,6.3; 45 3.95,5.8; 46 3.95,5.3; 47 3.95,4.8; 48 3.95,4.3; 49 3.95,3.8; 50 3.95,3.3 | smd 2.4 x 2.4: P$1 0.7,1.2; P$2 0.7,29.9

### Placement (x,y rotation side)
0  72.16,33.63 0 top
1  5.43,33.63 0 top
2  12.86,33.63 0 top
3  20.27,33.63 0 top
4  27.68,33.63 0 top
5  35.2,33.63 0 top
6  42.51,33.63 0 top
7  49.97,33.63 0 top
8  57.33,33.63 0 top
9  64.73,33.63 0 top
!  64.73,11.71 0 top
(  72.16,18.55 0 top
)  79.56,18.55 0 top
+  79.56,25.39 0 top
,  72.16,11.71 0 top
-  79.56,33.63 0 top
.  79.56,11.71 0 top
?  57.33,11.71 0 top
@  64.73,4.87 0 top
A  5.43,18.55 0 top
ANTENNA  39.55,91.4 0 bottom
AUDIO_L  32,93 0 bottom
AUDIO_R  29.5,85 0 bottom
B  35.2,11.71 0 top
C  20.27,11.71 0 top
C1  65.51,60 270 bottom
C2  33.05,49.85 0 bottom
C3  32.8,48.35 0 bottom
C4  28.6,48.5 90 bottom
C6  28,75 0 bottom
C7  35.15,49.05 270 bottom
C8  22.45,89.25 270 bottom
C9  48.25,51.05 270 bottom
C13  74.5,89.8 180 bottom
C14  69.5,84.33 270 bottom
C18  30,48.5 90 bottom
C19  32.45,72.4 0 bottom
C20  32.45,77.4 0 bottom
C21  28.3,72.7 0 bottom
C22  30.23,66.15 0 bottom
C23  24.8,62.55 180 bottom
C24  22.45,92.45 90 bottom
C25  29.95,91.8 270 bottom
C26  29.95,88.5 90 bottom
C27  47.9,86.8 270 bottom
C28  46.4,86.8 270 bottom
D  20.27,18.55 0 top
D1  26.35,81.9 0 bottom
D4  31.05,68.3 0 bottom
D5  64.5,90 180 bottom
E  20.27,25.39 0 top
F  27.68,18.55 0 top
FN-RIGHT  75.86,4.87 0 top
G  35.2,18.55 0 top
GND  33.5,85 0 bottom
H  42.51,18.55 0 top
I  57.33,25.39 0 top
IC1  75.55,85.05 90 bottom
IC2  65.45,51.25 270 bottom
J  49.97,18.55 0 top
K  57.33,18.55 0 top
L  64.73,18.55 0 top
L1  24.55,77.85 90 bottom
L3  42.23,90.6 90 bottom
M  49.97,11.71 0 top
N  42.51,11.71 0 top
O  64.73,25.39 0 top
P  72.16,25.39 0 top
Q  5.43,25.39 0 top
Q1  43.85,48.9 180 bottom
Q2  26.3,90.4 270 bottom
Q3  65.63,72.4 90 bottom
R  27.68,25.39 0 top
R1  69,56.9 0 bottom
R2  25,57.05 0 bottom
R3  74.1,59 180 bottom
R4  59.45,51.85 90 bottom
R5  57.35,51.85 90 bottom
R6  25,55 0 bottom
R11  38.6,86.9 0 bottom
R13  51.2,86.8 90 bottom
R14  53.35,86.8 90 bottom
R15  55.5,86.8 90 bottom
R16  58.8,85.15 0 bottom
R17  58.8,83.05 0 bottom
R18  37.15,59.9 180 bottom
R19  37.15,57.9 180 bottom
R20  37.15,55.9 180 bottom
R21  38.7,53.1 90 bottom
R22  40.75,53.1 90 bottom
R23  42.85,53.1 90 bottom
R24  40.9,49.05 270 bottom
R25  38.75,49.05 270 bottom
R29  37.65,85.1 0 bottom
R36  32.4,79.15 180 bottom
R37  31.35,75.1 90 bottom
R38  30.2,70.5 0 bottom
R39  60.55,88.5 270 bottom
R40  56.25,92.8 90 bottom
S  12.86,18.55 0 top
SHIFT-RIGHT  53.62,4.87 0 top
SHILFT-LEFT  9.14,4.87 0 top
SJ2  82.25,44.55 180 bottom
SPACE1  21.5,4.87 0 top
SPACE2  31.39,4.87 0 top
SPACE3  41.27,4.87 0 top
T  35.2,25.39 0 top
T1  59.55,92.9 90 bottom
U  49.97,25.39 0 top
U$2  28.25,78 270 bottom
U$3  25.9,70.05 270 bottom
U$4  76.67,71.9 270 bottom
U$5  69.65,62.25 180 bottom
U$6  29.8,54.1 0 bottom
U$7  75.6,29.65 45 bottom
U$8  35,89.7 0 bottom
U$9  74,94.7 180 bottom
U$10  25.85,65.85 180 bottom
U$11  76.55,44.55 180 top
V  27.68,11.71 0 top
W  12.86,25.39 0 top
X  12.86,11.71 0 top
X3  82.45,50.5 270 bottom
X5  48,53.2 0 bottom
Y  42.51,25.39 0 top
Z  5.43,11.71 0 top

### Tracks (layer width: path | path; a pad name or v marks a point on that pad's centre or on a via)
+3V3  (via drill 0.9)
  Top 0.61: v36.52,49.7 31.5,49.7 29.3,51.9 29.3,61.33 27.68,62.95 24.4,62.95 | v24.4,59.5 24.4,62.95 | 24.4,62.95 24.4,66.05 28.75,70.4 v39.4,70.4 39.2,70.6 v39.2,82.35 39.2,84.4 34.5,89.1 v32,89.1
  Bottom 0.254: 46,80 X5.3 48.15,80 | 46,79.5 X5.4 47.65,79.5 | X5.5 47.15,79 47.65,79.5 | X5.2 48.65,80.5 48.88,80.62 | 48.15,80 48.27,80.03 | 47.65,79.5 47.73,79.42 48.15,80 | X5.6 46.6,78.5 46.65,78.5 46.15,78 | X5.7 46.15,78 | X5.8 45.65,77.5 46.15,78 | U$6.1 32.92,51.18 33.8,50.35 C2.1 | R2.2 R6.2 24.15,59.25 v24.4,59.5 | U$8.11 33.7,88.4 33.7,87.7 | 33.7,87.7 34.25,87.7 U$8.10 | C28.1 40.1,87.55 R11.1 39.45,86.05 R29.1 39.2,84.4 v39.2,82.35 | 33.7,87.7 33.4,87.7 v32,89.1 | 33.8,48.65 C3.1 | X5.35 42.7,64 | C7.1 35.2,49.85
  Bottom 0.406: v39.4,70.4 39.4,67.3 42.7,64 | C7.1 33.85,49.8 C2.1 33.55,49.6 C3.1 | 35.2,49.85 35.35,49.7 v36.52,49.7
  Bottom 0.61: R39.2 R15.2 R14.2 R13.2 49.65,87.65 | 49.65,87.65 49.65,87.1 49.7,81.4 48.88,80.62 48.27,80.03 47.73,79.42 46.6,78.5 | 49.65,87.65 48.2,87.65 C27.1 C28.1
  Bottom 0.813: IC1.2 70.03,85.08 C14.1 63.12,85.08 R39.2
+5V  (via drill 0.9)
  Top 1.016: v81.05,90.35 77.6,93.8 50,93.8 46.15,90 46.15,67 | 46.15,67 46.15,60.8 v46.45,60.5 | v29.65,64.35 32.2,66.9 46.05,66.9 46.15,67
  Bottom 0.254: U$11.P$2 76.55,42.05 | X5.43 45.35,60
  Bottom 0.406: C6.1 28.43,73.92 25.95,73.92 | 25.95,73.92 25.95,70.4 26.35,70.03 26.88,70.03 27.2,69.7 U$3.4 27.05,68.7 U$10.4 | U$10.4 27.25,67.15 | SJ2.1 SJ2.2 | 72.7,90.9 U$9.1_+5V | 25.95,73.92 25.07,73.92 24.57,74.42 L1.1 | 45.35,60 46.45,60 | 46.45,60 v46.45,60.5 | C22.2 29,66.15 28,67.15 U$10.4 | 46.45,60 49.08,57.38 49.08,52.62 C9.1
  Bottom 0.61: C6.1 29.55,75.5 U$2.3 | X3.3 83.01,47.6 SJ2.2 | 24.35,76.7 L1.1 | C22.2 29.48,64.58 v29.65,64.35
  Bottom 0.813: 72.7,89.35 72.7,87.15 72.49,87.36 IC1.3 | C13.1 72.8,89.8 72.7,89.35 | 72.7,90.9 72.7,89.35
  Bottom 1.016: U$11.P$4 U$11.P$2 | 76.55,42.05 78.99,42.05 78.99,44.65 | 78.99,44.65 78.99,58.99 83.35,63.35 83.35,86.25 81.05,88.55 | 81.05,88.55 77.1,88.55 75.85,87.3 72.46,87.3 IC1.3 | SJ2.1 79.09,44.55 78.99,44.65 | 81.05,88.55 v81.05,90.35
+15V
  Bottom 0.406: D1.C 32.1,81.9 33.25,80.75 R36.2
  Bottom 0.61: D4.C 33.2,68.6 C19.1 C20.1 33.2,78.85 R36.2
AUDIO_L
  Bottom 0.254: C25.1 30.4,93 AUDIO_L.TP
AUDIO_R
  Bottom 0.254: 29.05,85.45 AUDIO_R.TP 29.5,87.3 C26.1
BASE
  Bottom 0.406: R40.1 T1.1
CE0
  Bottom 0.254: X5.38 45.15,62.5 45.42,62.23
  Bottom 0.406: 45.42,62.23 48.35,62.23 49.85,60.73 49.85,49.3 46.88,46.33 45.65,46.33 44.8,45.48 44.8,41.1 45.35,40.55 47.15,40.55 U$11.P$24
COL0  (via drill 0.9)
  Top 0.254: 1.IN 5.73,33.63 v5.45,33.65 | v12.85,33.65 12.84,33.65 2.IN | 3.IN 20.02,33.63 v20.27,33.65 | 4.IN 27.42,33.63 v27.68,33.65 | 5.IN 34.97,33.63 v35.2,33.65 | 6.IN 42.27,33.63 v42.5,33.62 | 7.IN 49.67,33.63 v49.98,33.62 | 8.IN 57.18,33.63 v57.33,33.62 | 9.IN 64.52,33.63 v64.72,33.65 | v72.12,33.65 71.92,33.63 0.IN | -.IN 80.27,33.63 v79.53,33.83
  Bottom 0.254: v12.85,33.65 v20.27,33.65 20.02,33.63 3.IN 20.29,33.65 v27.68,33.65 27.42,33.63 4.IN 27.7,33.65 v35.2,33.65 v42.5,33.62 42.27,33.63 6.IN 42.52,33.65 v49.98,33.62 49.7,33.6 v57.33,33.62 57.18,33.63 8.IN 57.34,33.65 v64.72,33.65 64.52,33.63 9.IN | U$7.29 74.25,33.48
  Bottom 0.406: 9.IN 65.58,34.48 70.83,34.48 v72.12,33.65 72.12,34.08 76.17,38.12 78.5,38.12 79.7,36.92 79.7,35.42 | 74.25,33.48 74.25,34 76.15,35.9 77.05,35.9 77.53,35.42 79.7,35.42 | v79.53,33.83 79.7,34 79.7,35.42
  Bottom 0.61: v5.45,33.65 v64.72,33.65
COL1  (via drill 0.9)
  Top 0.254: Q.IN 5.6,25.39 v5.3,25 | v12.9,25 W.IN | E.IN 20.3,24.99 20.3,25.05 | 27.55,25.39 R.IN 27.7,25.02 v27.7,25 | 27.55,25.39 v27.7,25 | T.IN 35.05,25.39 v35.15,25 | Y.IN 42.35,25.39 v42.48,25.27 | U.IN 49.8,25.39 v49.95,25.32 | I.IN 57.16,25.39 v57.3,25.3 | O.IN 64.59,25.39 v64.7,25.32 | P.IN 72.01,25.39 v72.12,25.35 | +.IN 80.3,25.39 v79.8,24.95 | 20.1,25 v20.25,25 | v20.25,25 20.3,25.05 | 20.3,25.05 20.35,25 v20.25,25 | 27.55,25.39 27.6,25.34 27.6,25 v27.7,25
  Top 0.406: 76.5,34.73 v76.53,34.73 76.53,32.2 78.12,30.6 78.12,28.4 76.55,26.82 76.55,21.7 v77.08,21.27
  Bottom 0.254: W.IN v12.9,25 v27.7,25 | v27.7,25 v35.15,25 35.05,25.39 T.IN 35.2,25 v42.48,25.27 42.35,24.99 42.51,24.99 42.66,25 v49.95,25.32 49.94,25.04 50.06,25.04 50.17,25 v57.3,25.3 v64.7,25.32 64.79,24.94 64.78,24.99 65.19,25 v72.12,25.35 | U$7.30 75.12,33.32 v76.53,34.73 | v20.25,25 v27.7,25
  Bottom 0.406: v64.7,25.32 64.7,21.43 65.58,20.48 76.28,20.48 v77.08,21.27 79.8,24.02 v79.8,24.95
  Bottom 0.61: v5.3,25 v64.7,25.32 v72.12,25.35
COL2  (via drill 0.9)
  Top 0.254: SHILFT-LEFT.IN 9.28,4.87 arc-90 v9.15,4.85 | v21.5,4.85 21.52,4.85 SPACE1.IN | SPACE2.IN 31.27,4.87 v31.45,4.85 | SPACE3.IN 41.23,4.87 v41.2,4.9 | SHIFT-RIGHT.IN 53.57,4.87 v53.55,4.85 | @.IN 64.67,4.87 v64.65,4.85 | FN-RIGHT.IN 75.72,4.87 v75.7,4.85
  Bottom 0.254: v75.7,4.85 v64.65,4.85 v53.55,4.85 41.25,4.85 v41.2,4.9 31.41,4.9 SPACE2.IN 31.43,4.87 v31.45,4.85 v21.5,4.85 | U$7.31 76.77,34 77.9,34 79.1,32.83 80.3,32.83 82.97,30.18 82.97,18.85 80.55,16.43 80.55,9.7 v75.7,4.85 | FN-RIGHT.IN 75.72,4.87 v75.7,4.85
  Bottom 0.61: v9.15,4.85 v75.7,4.85
COL3  (via drill 0.9)
  Top 0.254: Z.IN 5.25,11.7 v5.45,11.7 | v12.85,11.7 13.49,11.71 X.IN | C.IN 20.25,11.7 v20.2,11.7 | V.IN 27.66,11.7 v27.6,11.7 | B.IN 35.19,11.7 v35.05,11.7 | N.IN 42.49,11.7 v42.3,11.7 | M.IN 49.95,11.7 v49.7,11.7 | ?.IN v57.2,11.71 v57.2,11.7 | !.IN v64.55,11.71 v64.55,11.7 | ,.IN v72,11.71 v72,11.7 | ..IN v79.4,11.71 v79.4,11.7
  Bottom 0.254: v49.7,11.7 v49.69,11.71 49.15,11.71 | 49.15,11.71 N.IN 42.49,11.7 v42.3,11.7 v35.05,11.7 v35.04,11.71 V.IN 27.66,11.7 v27.6,11.7 v27.59,11.71 C.IN 20.25,11.7 v20.2,11.7 v12.85,11.7 | v57.2,11.7 49.15,11.7 49.15,11.71 | v64.55,11.7 v72,11.7 v79.4,11.7 | U$7.32 77.03,33.55 77.65,33.55 78.85,32.35 80.1,32.35 82.45,30 82.45,19.35 79.4,16.3 v79.4,11.7 | ..IN v79.41,11.71 v79.4,11.7
  Bottom 0.61: v64.55,11.7 v57.2,11.7 | v5.45,11.7 v79.4,11.7
COL4  (via drill 0.9)
  Top 0.254: ).IN v79.4,18.55 | v72.05,18.55 (.IN | L.IN v64.85,18.55 | K.IN v57.2,18.55 | J.IN v50.1,18.55 | H.IN v42.65,18.55 | G.IN v35.35,18.55 | F.IN v27.8,18.55 | D.IN v20.45,18.55 | S.IN v13.05,18.55 | A.IN v5.35,18.55
  Bottom 0.254: v13.05,18.55 v20.45,18.55 v27.8,18.55 v35.35,18.55 v42.65,18.55 v50.1,18.55 v57.2,18.55 v64.85,18.55 v72.05,18.55 v79.4,18.55 79.65,18.55 81.9,20.8 81.9,29.73 79.78,31.85 78.75,31.85 77.5,33.1 77.28,33.1 U$7.33
  Bottom 0.61: v5.35,18.55 v79.4,18.55
COLLECTOR
  Bottom 0.406: T1.3 64.85,92.9 65.75,92 65.75,90.02 D5.K
D/C
  Bottom 0.254: X5.37 45.6,63
  Bottom 0.406: 45.6,63 48.83,63 50.62,61.2 50.62,48.98 47.33,45.67 47.33,43.62 47.67,43.27 49.88,43.27 U$11.P$22
DE
  Bottom 0.254: X5.13 47.9,75 55.95,83.05 R17.2
DISPLAY_RESET
  Bottom 0.254: R13.1 51.2,81.8 46.4,77 X5.9 39.65,77 36.9,74.25 36.9,66 33.2,62.3 33.2,55.5 32.7,55.05 31.45,55.05 29.5,53.1 27,53.1 26.35,52.45 26.35,47.2 26.75,46.85 30.57,46.85 31.25,46.17 32.67,46.17 33.35,45.5 33.35,44.57 U$11.P$35
FB
  Bottom 0.406: C20.2 31.35,77.05 R37.2
  Bottom 0.61: 31.7,78.9 R36.1 | R36.1 31.3,79.15 | U$2.2 31.7,78 | 31.7,77.45 31.65,77.35 C20.2 31.7,77.45 | 31.7,77.45 31.7,78 | 31.7,78 31.7,78.75 R36.1
FM_RST
  Bottom 0.254: U$8.5 37,88.95 37.75,88.2 R11.2 37.65,86.8 37.65,84.2 36.35,82.9 36.35,66.15 32.7,62.5 32.7,56 32.35,55.65 31.2,55.65 29.2,53.65 26.85,53.65 25.85,52.65 25.85,46.95 26.55,46.3 30.3,46.3 30.8,45.75 30.8,44.58 U$11.P$37
GND  (via drill 0.9)
  Top 0.254: 26.95,84.9 27.55,84.3 34,84.3 | 27.2,83.95 28.25,83.95
  Bottom 0.254: 75.42,28.57 U$7.THERMAL 75.42,29.83 U$7.VIA4 | GND.TP 34.2,84.3 34,84.3 | 44,65.5 45.73,65.5 45.9,65.67 45.9,66 | U$9.5_0V 75.3,92.45 U$9.P$7 | U$8.14 35.1,89.95 | 35.1,89.95 35.5,89.95 | 35.1,89.95 35.1,89.7 U$8.P$1 34.25,88.95 U$8.12 33.6,88.95 | U$8.13 35,89.45 35.5,89.95 | 37.4,90.4 37.4,89.95 U$8.3 35.5,89.95 | U$7.37 76.66,29.65 | 76.66,29.65 U$7.VIA3 | 76.66,29.65 U$7.4 78.69,27.62 79.12,27.62 79.9,28.4 79.9,28.57 79.36,29.12 U$7.1 | 76.66,29.65 | X5.50 44.05,53.5 v46.55,51 | U$6.6 28.82,50.33 28.62,50.12 27.52,50.12 27.25,49.85 27.25,48.17 27.68,47.75 C4.1 | U$6.14 30.77,59.02 v31.1,59.35 32.08,58.38 U$6.16 | X5.1 42.65,81 v42.65,84.55
  Bottom 0.305: 41.8,74 41.75,74.5 X5.14 45.95,74.5 45.9,74 | 41.8,74 41.8,73.5 | 41.8,73.5 41.8,73 | 41.8,73 41.8,72.5 | 41.8,72.5 41.8,72 | 41.8,72 41.8,71.5 | 41.8,71.5 41.8,71 | 41.8,71 41.8,70.5 | 41.8,70.5 41.8,70 | 41.8,70 41.8,69.5 | 41.8,68.5 41.8,68 | 41.8,68 41.8,67.5 | 41.8,67.5 41.8,67 | 41.8,67 41.8,66.5 | 41.8,66.5 41.8,66 | 41.8,66 42.15,65.5 44,65.5 X5.32 | 41.8,66 X5.31 45.9,66 45.9,66.5 | 41.8,66.5 X5.30 45.9,66.5 | 41.8,67 X5.29 45.9,67 | 41.8,67.5 X5.28 45.9,67.5 | 41.8,68 X5.27 45.9,68 | 41.8,68.5 X5.26 45.9,68.5 | 41.8,69.5 X5.24 45.9,69.5 | 41.8,69.5 41.8,69 | 41.8,69 X5.25 45.9,69 | 41.8,69 41.8,68.5 | 41.8,70 X5.23 45.9,70 | 41.8,70.5 X5.22 45.9,70.5 | 41.8,71 X5.21 45.9,71 | 41.8,71.5 X5.20 45.9,71.5 | 41.8,72 X5.19 45.9,72 | 41.8,72.5 X5.18 45.9,72.5 | 41.8,73 X5.17 45.9,73 | 41.8,74 X5.15 45.9,74 | 41.8,73.5 X5.16 45.9,73.5 | 45.9,74 45.9,73.5 | 45.9,73.5 45.9,73 | 45.9,73 45.9,72.5 | 45.9,72.5 45.9,72 | 45.9,72 45.9,71.5 | 45.9,71.5 45.9,71 | 45.9,71 45.9,70.5 | 45.9,70.5 45.9,70 | 45.9,70 45.9,69.5 | 45.9,69.5 45.9,69 | 45.9,69 45.9,68.5 | 45.9,68.5 45.9,68 | 45.9,68 45.9,67.5 | 45.9,67.5 45.9,67 | 45.9,67 45.9,66.5
  Bottom 0.406: 24.4,63.6 U$10.2 | R38.1 30.7,70.85
  other vias: 41.25,75.5
  pour Bottom (isolate 0.305, rank 2): 0,39 0,3 arc90 3,0 82,0 arc90 85,3 85,92.6 arc90 81.6,96 21.41,96.2 arc90 20.5,95.04 20.5,40 1,40 arc90
  pour Top (isolate 0.305, rank 2): 0,39 0,3 arc90 3,0 82,0 arc90 85,3 85,92.6 arc90 81.6,96 21.5,96 arc90 20.5,95 20.5,40 1,40 arc90
GPIO23
  Top 0.254: 58.77,42.05 U$11.P$16
GPIO24
  Top 0.254: 56.23,42.05 U$11.P$18
H_SYNC
  Bottom 0.254: X5.11 47.15,76 55.5,84.35 R15.1 55.5,85.65
ID_SC
  Bottom 0.406: U$11.P$28 43.53,40.57 44.42,39.67 64.25,39.67 65.12,40.55 65.12,49.67 64.17,50.62 IC2.6 59.84,50.62 R4.1
ID_SD  (via drill 0.9)
  Top 0.61: U$11.P$27 43.53,46.58 44.5,47.55 57.45,47.55 v58.25,48.35
  Bottom 0.406: IC2.5 58.33,49.34 | 58.33,49.34 58.03,49.34 57.33,50.05 57.33,50.98 R5.1 | v58.25,48.35 58.25,49.27 58.33,49.34
IN_1
  Bottom 0.61: U$3.1 27.2,72.5 C21.2
INT  (via drill 0.9)
  Top 0.406: v26.8,60.2 26.55,59.95 26.55,40.2 27.02,39.73 66.47,39.73 67.65,40.9 67.65,43.27 U$11.P$7 | v67.55,21.95 67.78,22.18 67.78,35.95 v67.25,36.48
  Bottom 0.254: U$5.7 69.02,55.98 | 68.95,44.57 U$11.P$7 | U$6.10 28.18,58.83 v26.8,60.2 | 73.8,25.5 74,25.57 U$7.12
  Bottom 0.406: v67.25,36.48 67.65,36.7 67.65,43.27 U$11.P$7 68.93,46.16 71.12,48.35 71.12,53.85 69.02,55.96 69.02,55.98 | v67.55,21.95 67.6,21.95 69.1,23.45 72.78,23.45 73.53,24.2 73.53,25.23 73.8,25.5
IR_RX
  Top 0.254: X3.1 81.69,53.04 81.68,53.05 | 63.8,44.6 U$11.P$11
  Top 0.61: 63.8,44.6 63.8,50.4 66.44,53.04 X3.1
IR_TX  (via drill 0.9)
  Top 0.61: v53.9,90.35 50.95,87.4 50.95,61.05 35.91,46.01 U$11.P$33
  Bottom 0.61: v53.9,90.35 53.9,92.78 54.77,93.65 R40.2
LEDK1
  Bottom 0.254: X5.44 38.4,59.5 R18.2
  Bottom 0.305: 38,59.65 R18.2
LEDK2
  Bottom 0.254: X5.45 41.25,59 40.15,57.9 R19.2
LEDK3
  Bottom 0.254: X5.46 41.65,58.5 39.05,55.9 R20.2
LEDK4
  Bottom 0.254: R21.2 39.15,54.4 39.15,55.05 42.1,58 X5.47
LEDK5
  Bottom 0.254: 40.7,54 R22.2 40.75,55.75 42.5,57.5 X5.48
LEDK6
  Bottom 0.254: X5.49 42.9,57 42.45,56.55 42.45,54.35 R23.2
LX
  Bottom 0.61: D1.A 24.35,81.35 24.55,81.15 L1.2 24.4,78.95 U$2.5
MISO
  Bottom 0.254: X5.33 45.95,65 46.38,65.35
  Bottom 0.406: 46.38,65.35 49.8,65.35 53.1,62.02 53.1,48.7 54.98,46.83 54.98,43.77 54.48,43.27 52.42,43.27 U$11.P$21
MOSI
  Bottom 0.254: X5.34 46.42,64.5
  Bottom 0.406: 46.42,64.5 49.5,64.5 52.17,61.83 52.17,48.33 53.69,46.81 U$11.P$19
N$1
  Bottom 0.254: U$8.17 34.25,93.7 33.05,94.9 26.48,94.9 Q2.4 C24.2
N$11
  Bottom 0.61: Q3.1 64.11,68.29 65,67.4 66.8,67.4 67.75,66.45 U$5.1
N$12
  Bottom 0.61: R18.1 R19.1 R20.1 36.3,53.45 37.5,52.25 R21.1 R22.1 R23.1 43.95,52.25 44.8,51.4 Q1.2
N$13
  Bottom 0.61: Q3.4 69.02,67.75 U$5.2
N$16
  Bottom 0.61: C21.1 29.35,72.5 R38.2 D4.A
N$19
  Bottom 0.254: U$8.9 34.75,87.45 34.4,87.1 32,87.1 30.6,88.5 29.2,88.5 27.82,89.88 | 27.82,89.88 Q2.1 | C8.1 22.57,89.88 27.82,89.88
N$20
  Bottom 0.61: Q1.1 R24.1
N$22
  Bottom 0.254: C25.2 30.03,90.97 U$8.16
N$23
  Bottom 0.254: C26.2 31.15,90.45 U$8.15
N$25
  Bottom 0.254: U$8.4 38.95,89.45 39.55,90.05 ANTENNA.MP 41.67,91.4 L3.2
N$26
  Bottom 0.254: U$8.6 36.27,85.63 R29.2
N$30
  Bottom 0.406: R39.1 61.23,90 D5.A
OUT1_IN2
  Bottom 0.406: U$3.3 24.75,69.25 U$10.1
OUT2
  Bottom 0.254: 26.9,64.5 26.9,63.9 C23.2
  Bottom 0.305: U$10.3 26.9,64.5
P_CLK
  Bottom 0.254: X5.12 47.5,75.5 57.15,85.15 R16.2 | 57.75,85.15 R16.2 | 57.6,85.15 R16.2
PWM
  Bottom 0.61: U$11.P$29 40.99,48.11 R24.2 R25.2
RANDOM
  Bottom 0.305: C23.1 24.02,62.53
  Bottom 0.406: U$11.P$32 38.45,39.88 37.83,39.25 23.57,39.25 22.7,40.12 22.7,61.2 C23.1
ROW0  (via drill 0.9)
  Top 0.254: 6.85,10.35 arc90 7.4,10.9 7.4,11.65 arc90 Z.OUT Z.OUT arc-90 5.4,13.64 | 8.2,6.75 9.12,6.75 SHILFT-LEFT.OUT | 1.OUT 1.OUT arc90 3.5,33.6 arc90 5.45,31.65 7.55,31.65 v7.6,31.6 | 5.45,27.3 arc-90 Q.OUT 5.34,27.29 arc90 3.45,25.4 3.45,25.3 arc90 5.4,23.35 | 5.4,20.48 arc90 A.OUT 5.3,20.45 arc90 3.4,18.55 3.4,18.4 arc90 5.4,16.4
  Top 0.61: 5.45,31.65 5.43,31.64 Q.OUT | 5.4,23.35 5.43,23.32 A.OUT | 5.4,16.4 5.43,16.36 Z.OUT | 8.2,6.75 6.85,8.1 6.85,10.35
  Bottom 0.254: U$7.15 72.9,26.6 12.6,26.6 v7.6,31.6
ROW1  (via drill 0.9)
  Top 0.254: 2.OUT 12.73,35.53 arc90 10.85,33.65 10.85,33.55 arc90 12.85,31.55 14.75,31.55 v14.85,31.45 | W.OUT arc90 W.OUT 12.74,27.29 arc90 10.85,25.4 10.85,25.35 arc90 12.9,23.3 | 12.9,20.5 arc-90 S.OUT 12.75,20.45 arc90 10.85,18.55 10.85,18.45 arc90 12.85,16.45 | X.OUT arc90 X.OUT
  Top 0.61: 12.9,23.3 12.86,23.25 S.OUT | 12.85,31.55 12.86,31.55 W.OUT | 12.85,16.45 12.86,16.45 X.OUT
  Bottom 0.254: U$7.16 72.65,27.05 19.25,27.05 v14.85,31.45
ROW2  (via drill 0.9)
  Top 0.254: 20.25,9.65 arc90 22.2,11.6 22.2,11.75 arc90 20.34,13.61 C.OUT arc90 20.3,13.64 | 20.3,16.55 arc-90 18.3,18.55 arc-90 20.2,20.45 D.OUT arc-90 20.25,20.46 | 20.25,23.3 arc-90 18.25,25.3 18.25,25.4 arc-90 20.14,27.29 E.OUT arc-90 20.25,27.3 | 3.OUT 20.18,35.53 arc90 18.3,33.65 18.3,33.5 arc90 20.25,31.55 v22.45,31.55
  Top 0.61: 20.25,31.55 20.27,31.54 E.OUT | 20.25,23.3 20.27,23.29 D.OUT | 20.3,16.55 20.27,16.52 C.OUT | SPACE1.OUT 20.25,8.02 20.25,9.65
  Bottom 0.254: U$7.17 72.39,27.5 26.5,27.5 v22.45,31.55
ROW3  (via drill 0.9)
  Top 0.254: 4.OUT 27.53,35.53 arc90 25.65,33.65 arc90 27.7,31.6 27.7,31.35 27.95,31.6 v29.85,31.6 | 27.7,27.32 arc-90 R.OUT 27.59,27.29 arc90 25.7,25.4 25.7,25.2 arc90 27.65,23.25 | 27.65,20.48 arc90 F.OUT 27.6,20.45 arc90 25.7,18.55 25.7,18.45 arc90 27.65,16.5 | 27.65,13.63 arc90 V.OUT 27.79,13.61 arc-90 29.7,11.7 29.7,11.05 arc-90 29,10.35 | 30.55,6.75 31.36,6.75 SPACE2.OUT
  Top 0.61: 27.7,31.35 27.68,31.32 R.OUT | 27.65,16.5 27.68,16.48 V.OUT | 27.65,23.25 27.68,23.23 F.OUT | 30.55,6.75 29,8.3 29,10.35
  Bottom 0.254: U$7.18 72.13,27.95 33.5,27.95 v29.85,31.6
ROW4  (via drill 0.9)
  Top 0.254: 35.2,16.5 arc-90 33.25,18.45 33.25,18.55 arc-90 35.15,20.45 G.OUT arc90 G.OUT | B.OUT arc-90 B.OUT | 35.2,23.35 arc-90 33.3,25.25 33.3,25.4 arc-90 T.OUT T.OUT arc90 T.OUT | 5.OUT 35.03,35.53 arc90 33.15,33.65 33.15,33.55 arc90 35.2,31.5 35.35,31.65 v37.3,31.65
  Top 0.61: 35.2,31.5 T.OUT | 35.2,23.35 35.2,23.34 G.OUT | 35.2,16.5 B.OUT
  Bottom 0.254: U$7.19 71.88,28.4 40.55,28.4 v37.3,31.65
ROW5  (via drill 0.9)
  Top 0.254: 6.OUT 42.48,35.53 arc90 40.55,33.6 40.55,33.45 arc90 42.5,31.5 42.6,31.6 v44.75,31.6 | Y.OUT arc90 Y.OUT 42.49,27.29 arc90 40.6,25.4 40.6,25.3 arc90 42.5,23.4 | H.OUT arc90 H.OUT 42.4,20.45 arc90 40.45,18.5 40.45,18.45 arc90 42.5,16.4 | N.OUT arc90 N.OUT 42.41,13.61 arc90 40.5,11.7 40.5,11.2 arc90 41.75,9.95
  Top 0.61: 42.5,31.5 42.51,31.5 Y.OUT | 42.5,23.4 42.51,23.39 H.OUT | 42.5,16.4 42.51,16.39 N.OUT | SPACE3.OUT 41.27,9.46 41.75,9.95
  Bottom 0.254: U$7.20 71.62,28.85 47.5,28.85 v44.75,31.6
ROW6  (via drill 0.9)
  Top 0.254: 51.35,10.25 arc90 52,10.9 52,11.7 arc90 50.09,13.61 M.OUT arc-90 49.95,13.62 | 52.65,6.75 53.6,6.75 SHIFT-RIGHT.OUT | 49.95,16.5 arc-90 47.9,18.55 47.9,18.6 arc-90 49.75,20.45 J.OUT arc-90 49.95,20.46 | 49.95,23.4 arc-90 48,25.35 48,25.4 arc-90 49.89,27.29 U.OUT arc90 50,27.32 | 7.OUT 49.93,35.53 arc90 48,33.6 48,33.5 arc90 50,31.5 50.45,31.95 v52.3,31.95
  Top 0.61: 50,31.5 49.97,31.46 U.OUT | 49.95,23.4 49.97,23.39 J.OUT | 49.95,16.5 49.97,16.48 M.OUT | 52.65,6.75 51.35,8.05 51.35,10.25
  Bottom 0.254: U$7.21 71.12,30.95 53.3,30.95 v52.3,31.95
ROW7  (via drill 0.9)
  Top 0.254: 8.OUT 57.23,35.53 arc90 55.3,33.6 55.3,33.5 arc90 57.3,31.5 57.8,31.5 58.4,32.1 v59.7,32.1 | 57.3,27.32 arc90 I.OUT 57.19,27.29 arc90 55.3,25.4 arc90 57.35,23.35 | 57.35,20.48 arc-90 K.OUT 57.3,20.45 arc90 55.4,18.55 55.4,18.35 arc90 57.3,16.45 | 57.3,13.63 arc90 ?.OUT
  Top 0.61: 57.3,31.5 57.33,31.48 I.OUT | 57.35,23.35 57.33,23.32 K.OUT | 57.3,13.63 57.3,16.45
  Bottom 0.254: U$7.22 71.33,31.45 60.35,31.45 v59.7,32.1
ROW8  (via drill 0.9)
  Top 0.254: 64.75,9.65 arc-90 62.7,11.7 arc-90 64.61,13.61 !.OUT arc-90 64.7,13.64 | 64.75,6.79 arc-90 @.OUT | 64.7,16.5 arc-90 62.75,18.45 62.75,18.55 arc-90 64.65,20.45 L.OUT arc90 64.75,20.46 | 64.75,23.25 arc-90 62.7,25.3 62.7,25.35 arc-90 64.64,27.29 O.OUT arc90 64.75,27.3 | 9.OUT 64.63,35.53 arc90 62.7,33.6 62.7,33.55 arc90 64.75,31.5 65.35,31.5 65.95,32.3 v66.33,32.45
  Top 0.61: 64.7,16.5 64.73,16.46 !.OUT | 64.75,23.25 64.73,23.23 L.OUT | 64.75,31.5 64.73,31.48 O.OUT | 64.75,6.79 64.75,9.65
  Bottom 0.254: U$7.23 71.53,31.95 66.75,31.95 v66.33,32.45
ROW9  (via drill 0.9)
  Top 0.254: 72.2,16.5 arc-90 70.2,18.5 70.2,18.55 arc-90 72.1,20.45 (.OUT arc-90 (.OUT | 72.2,13.65 arc-90 ,.OUT 72.34,13.61 arc-90 74.2,11.75 74.2,11.05 arc-90 73.45,10.3 | 0.OUT 71.88,35.53 arc90 70.1,33.75 | 70.1,33.75 arc90 72.2,31.65 | 72.2,27.34 arc-90 P.OUT 72.04,27.29 arc90 70.15,25.4 70.15,25.35 arc90 72.15,23.35 72.16,23.34 | 75,6.8 75.83,6.8 FN-RIGHT.OUT | v70.33,32.8 70.5,33.2 70.15,33.2 70.1,33.25 70.1,33.75
  Top 0.61: 72.2,31.65 72.16,31.61 P.OUT | 72.16,23.34 (.OUT | 72.2,16.5 72.16,16.45 ,.OUT | 75,6.8 73.45,8.35 73.45,10.3
  Bottom 0.254: U$7.24 71.41,32.8 v70.33,32.8
ROW10  (via drill 0.9)
  Top 0.254: 79.55,27.3 arc90 +.OUT | +.OUT 79.49,27.29 arc90 77.6,25.4 77.6,25.35 arc90 79.6,23.35 | 79.6,20.48 arc-90 ).OUT ).OUT arc90 77.65,18.55 77.65,18.5 arc90 79.55,16.6 | 79.55,13.62 arc90 ..OUT | 79.27,35.53 -.OUT 79.48,35.53 arc90 77.6,33.65 77.6,33.55 arc90 79.55,31.6 78.75,31.6 | 78.75,27.29 +.OUT
  Top 0.406: v78.1,36.7 78.39,36.7 -.OUT
  Top 0.61: 79.6,20.48 79.6,23.35 | 79.55,13.62 79.55,16.6 | 78.75,27.29 +.OUT 79.55,31.6
  Bottom 0.254: U$7.25 72.65,32.25
  Bottom 0.406: 72.65,32.25 72.65,32.5 73.33,33.17 73.33,34.2 76.15,37.02 77.78,37.02 v78.1,36.7
SCK
  Bottom 0.254: X5.36 45.15,63.5 45.33,63.67
  Bottom 0.406: 45.33,63.67 49.3,63.67 51.48,61.5 51.48,48.7 48.61,45.84 U$11.P$23
SCL_3V3  (via drill 0.9)
  Top 0.406: U$11.P$5 70.22,43.3 70.22,40.23 68.9,38.9 26.43,38.9 25.45,39.88 v25.45,44.65 | v69.95,22.05 68.78,23.23 68.78,35.77 v69.4,36.4
  Bottom 0.254: 71.45,44.57 U$11.P$5 | U$8.7 35.75,88 35.8,87.95 35.8,66.35 29.48,60.02 U$6.12 29.48,56.38 28.1,55 R6.1 25.85,53.55 25.3,53 25.3,44.8 v25.45,44.65 | 74.72,25.48 74.72,25.59 U$7.11
  Bottom 0.406: v69.4,36.4 70.22,37.23 70.22,43.3 U$11.P$5 71.47,46.09 72.53,47.15 72.53,54.23 R1.1 70.28,57.34 U$5.6 | v69.95,22.05 72.47,22.05 74.35,23.93 74.35,25.1 74.72,25.48
SDA_3V3  (via drill 0.9)
  Top 0.406: v23.95,42.4 23.93,42.38 23.93,40.02 25.88,38.08 72.75,38.08 | v75,22.15 75.28,22.43 75.28,26.73 73.67,28.32 73.67,30.82 75.3,32.45 75.3,37.27 74.5,38.08 72.75,38.08 | 72.75,38.08 72.75,42.81 U$11.P$3
  Bottom 0.254: U$8.8 35.25,66.75 28.82,60.33 U$6.11 28.82,56.48 28.45,56.1 26.8,56.1 R2.1 25,56.2 25,53.55 23.95,52.5 v23.95,42.4 | 76.38,25.35 76.38,25.69 U$7.10
  Bottom 0.406: U$5.5 71.56,59 R3.1 73.25,56.3 74.01,55.54 U$11.P$3 | v75,22.15 76.38,23.52 76.38,25.35
STEPUP_ENABLE
  Bottom 0.406: U$11.P$31 39.73,43.27 39.73,39.55 38.4,38.23 23.18,38.23 21.82,39.58 21.82,83.2 22.88,84.25 25.88,84.25 26.85,83.28 26.85,81 27.25,80.6 28.85,80.6 29.55,79.9 U$2.1
TOUCH_X+  (via drill 0.9)
  Top 0.61: v39.25,63.85 34.9,59.5 v34.9,52
  Bottom 0.254: C2.2 31.43,50.62 U$6.2 31.43,52.02 32.15,52.75 34.15,52.75 v34.9,52 | X5.39 41.1,62 v39.25,63.85
TOUCH_X-
  Bottom 0.254: X5.41 40.1,61 39.25,61.85 35.25,61.85 34.3,60.9 34.3,54.85 33.4,53.95 31.85,53.95 30.15,52.25 30.15,51.21 U$6.4 30.12,49.17 C18.2
TOUCH_Y+
  Bottom 0.254: X5.42 39.75,60.5 38.9,61.35 35.5,61.35 34.8,60.65 34.8,54.55 33.65,53.4 32.05,53.4 30.77,52.12 U$6.3 30.77,50.08 31.95,48.9 C3.2
TOUCH_Y-
  Bottom 0.254: X5.40 40.4,61.5 39.55,62.35 34.95,62.35 33.75,61.15 33.75,55.15 33.05,54.5 31.65,54.5 29.48,52.33 U$6.5 29.48,50.08 28.7,49.3 C4.2
V+
  Bottom 0.406: IC2.8 59.91,53.16 R4.2 R5.2 56.42,52.7 56.12,52.4 56.12,44.66 U$11.P$17
V_SYNC
  Bottom 0.254: X5.10 46.75,76.5 53.35,83.1 R14.1
VBAT+
  Bottom 0.61: U$5.3 70.28,77.91 71.92,79.55 U$4.+
VCC  (via drill 0.9)
  Top 0.406: v80.92,29.38 83.22,31.68 83.25,37.85 U$11.P$1
  Bottom 0.254: 67.75,57.01 R1.2 | U$7.38 79.14,31.43 79.47,31.43 79.66,31.24 | U$7.39 79.66,31.24 | 79.66,31.24 | 79.66,31.24 80.95,29.95 v80.92,29.38
  Bottom 0.305: U$5.8
  Bottom 0.406: U$11.P$1 76.55,57.4 R3.2 74.95,60.1 73.58,61.48 68.47,61.48 67.75,60.75 | R1.2 67.75,57.3 U$5.8 67.75,60.75 | 67.75,60.75 C1.1

### Text on the board
bNames: TCA8424 | 10uF